# EAGLE design 2021-04-21 specMech (EAGLE 9.6.2)

## Sheet 1 of 9: Curiosity Nano
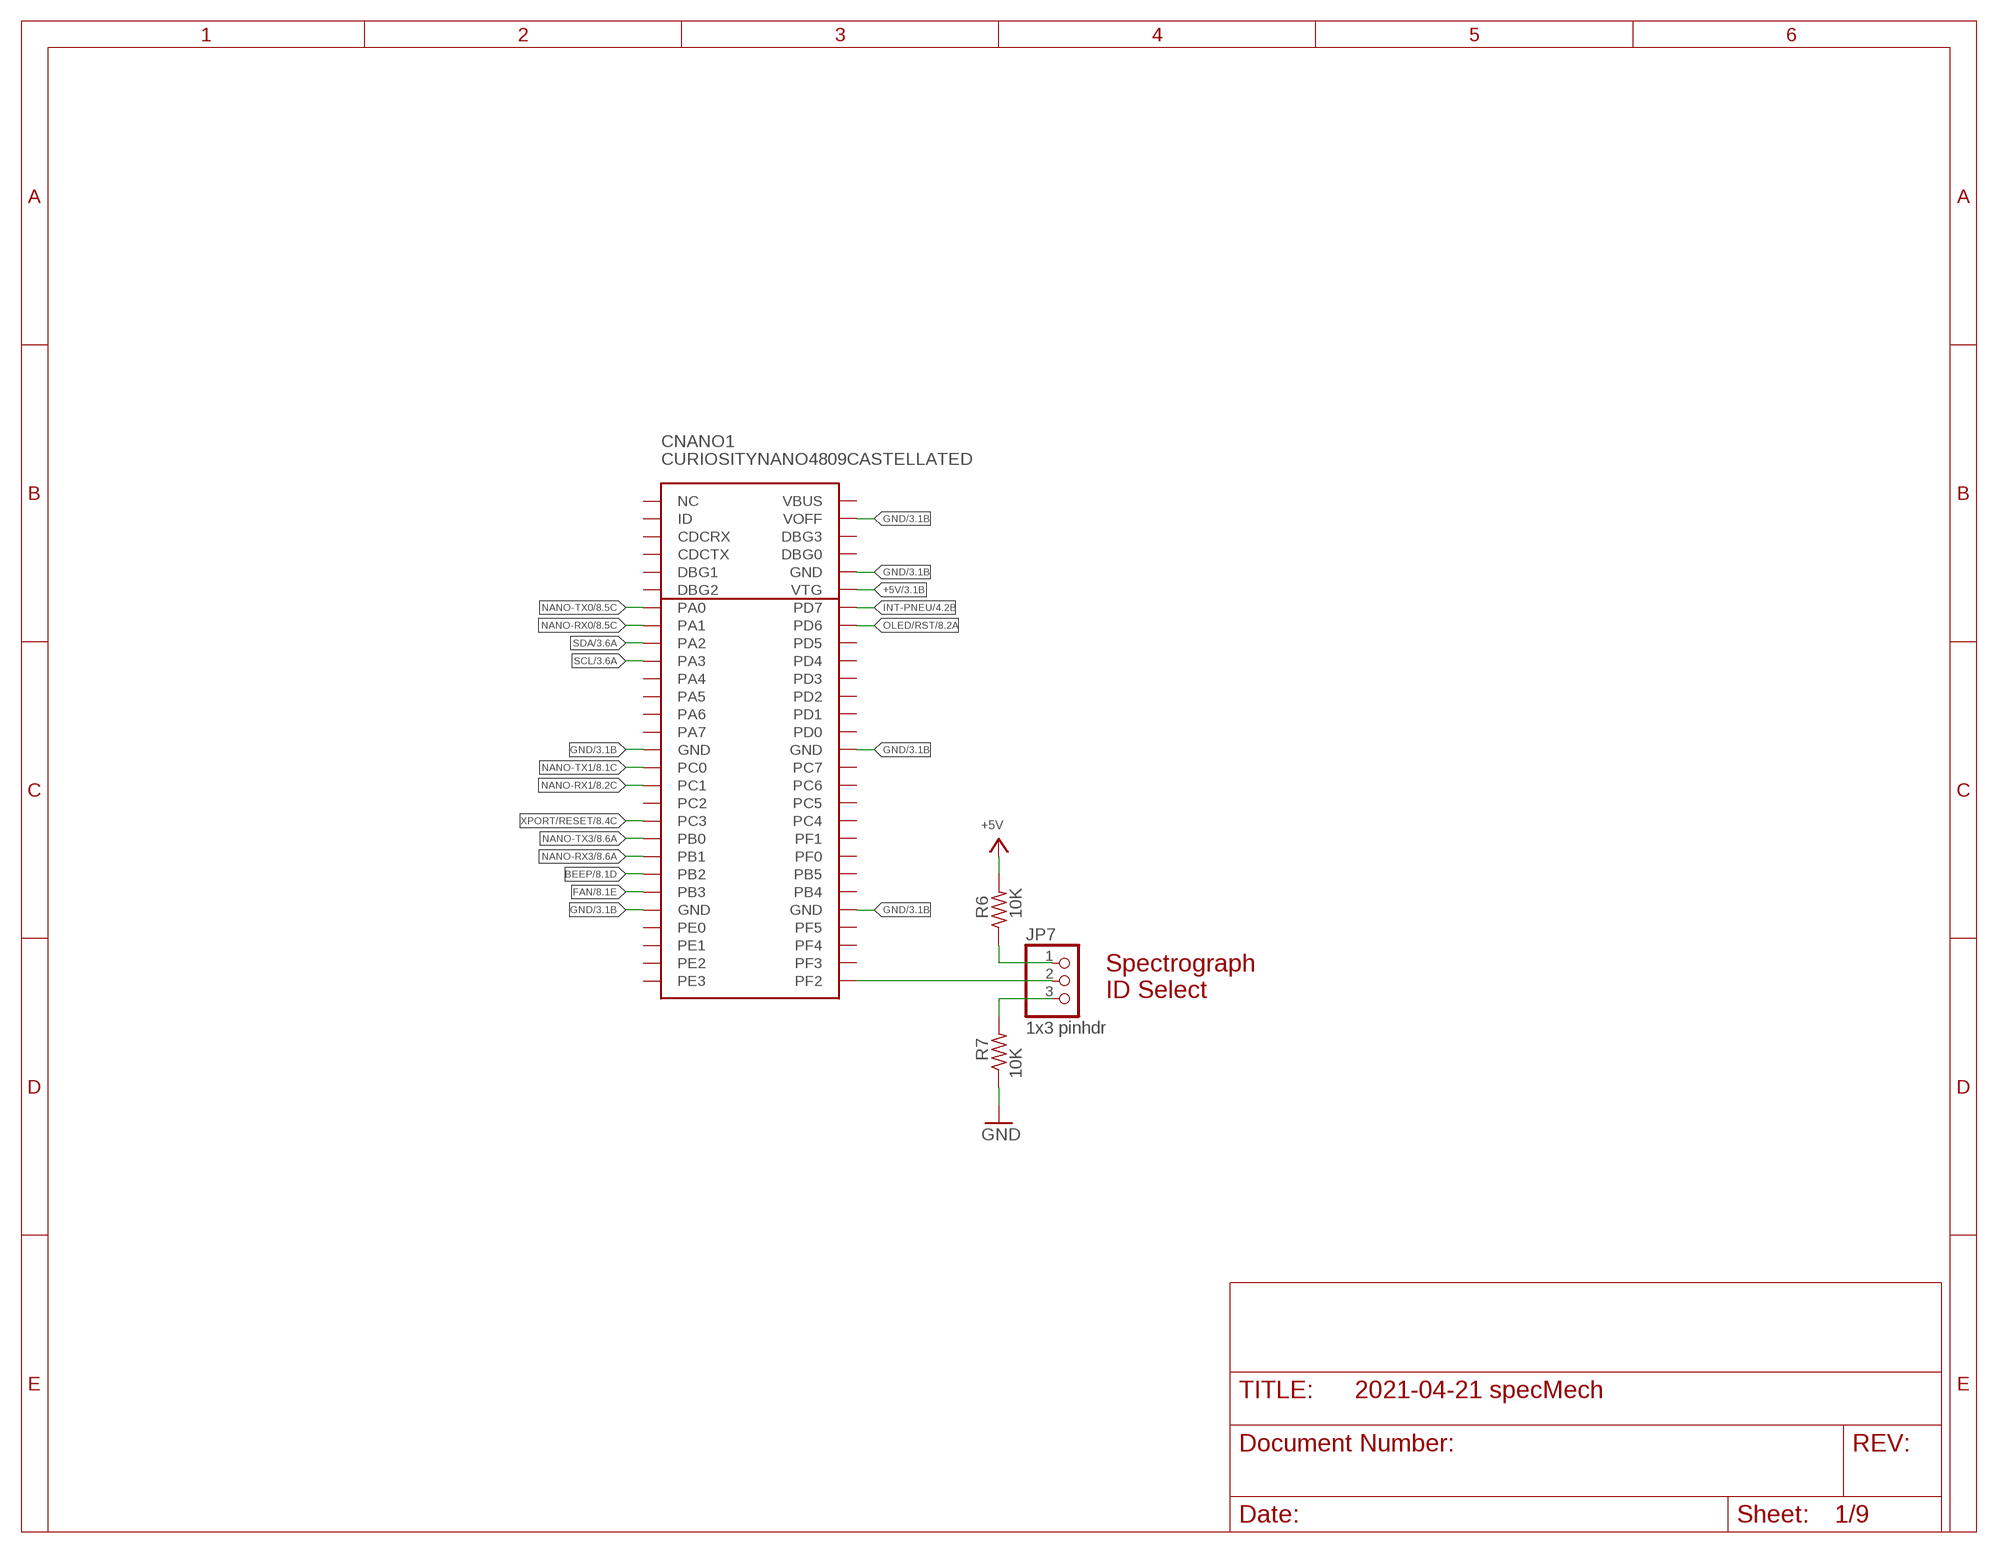
[diagram p0: schematic, sheet 1]

### Parts
CNANO1  CURIOSITYNANO4809CASTELLATED  [CURIOSITYNANO4809CASTELLATED]
JP7  1x3 pinhdr  PINHD-1X3  [1X03]
R6  10K  R-US_R0805  [R0805]
R7  10K  R-US_R0805  [R0805]

### Nets
+5V: CNANO1.VTG R6.2 ; also sheet 2,3,4,5,6,7,8,9
BEEP: CNANO1.PB2 ; also sheet 8
FAN: CNANO1.PB3 ; also sheet 8
GND: CNANO1.GND15(GND) CNANO1.GND24(GND) CNANO1.GND33(GND) CNANO1.GND42(GND) CNANO1.GND52(GND) CNANO1.VOFF R7.1 ; also sheet 2,3,4,5,6,7,8,9
INT-PNEU: CNANO1.PD7-AIN7(PD7) ; also sheet 4
N$6: CNANO1.PF2 JP7.2
N$7: JP7.3 R7.2
N$26: JP7.1 R6.1
NANO-RX0: CNANO1.PA1-RX(PA1) ; also sheet 8
NANO-RX1: CNANO1.PC1-RX(PC1) ; also sheet 8
NANO-RX3: CNANO1.PB1-RX(PB1) ; also sheet 8
NANO-TX0: CNANO1.PA0-TX(PA0) ; also sheet 8
NANO-TX1: CNANO1.PC0-TX(PC0) ; also sheet 8
NANO-TX3: CNANO1.PB0-TX(PB0) ; also sheet 8
OLED/RST: CNANO1.PD6-AIN6(PD6) ; also sheet 8
SCL: CNANO1.PA3-SCL(PA3) ; also sheet 3,4,5,6,7,8,9
SDA: CNANO1.PA2-SDA(PA2) ; also sheet 3,4,5,6,7,8,9
XPORT/RESET: CNANO1.PC3 ; also sheet 8
Unconnected: CNANO1.ID CNANO1.NC CNANO1.PA4-MOSI(PA4) CNANO1.PA5-MISO(PA5) CNANO1.PA6-SCK(PA6) CNANO1.PA7-SS(PA7) CNANO1.PB0-RX(CDCRX) CNANO1.PB1-TX(CDCTX) CNANO1.PB4 CNANO1.PB5 CNANO1.PC2 CNANO1.PC4 CNANO1.PC5 CNANO1.PC6 CNANO1.PC7 CNANO1.PD0-AIN0(PD0) CNANO1.PD1-AIN1(PD1) CNANO1.PD2-AIN2(PD2) CNANO1.PD3-AIN3(PD3) CNANO1.PD4-AIN4(PD4) CNANO1.PD5-AIN5(PD5) CNANO1.PE0 CNANO1.PE1 CNANO1.PE2 CNANO1.PE3 CNANO1.PF0-TOSC1(PF0) CNANO1.PF1-TOSC2(PF1) CNANO1.PF2-6(DBG2) CNANO1.PF3 CNANO1.PF3-5(DBG1) CNANO1.PF4 CNANO1.PF5-LED(PF5) CNANO1.PF6-SW0(DBG3) CNANO1.UPDI(DBG0) CNANO1.VBUS

### Notes on the sheet
- Spectrograph
  ID Select

## Sheet 2 of 9: +5V Power
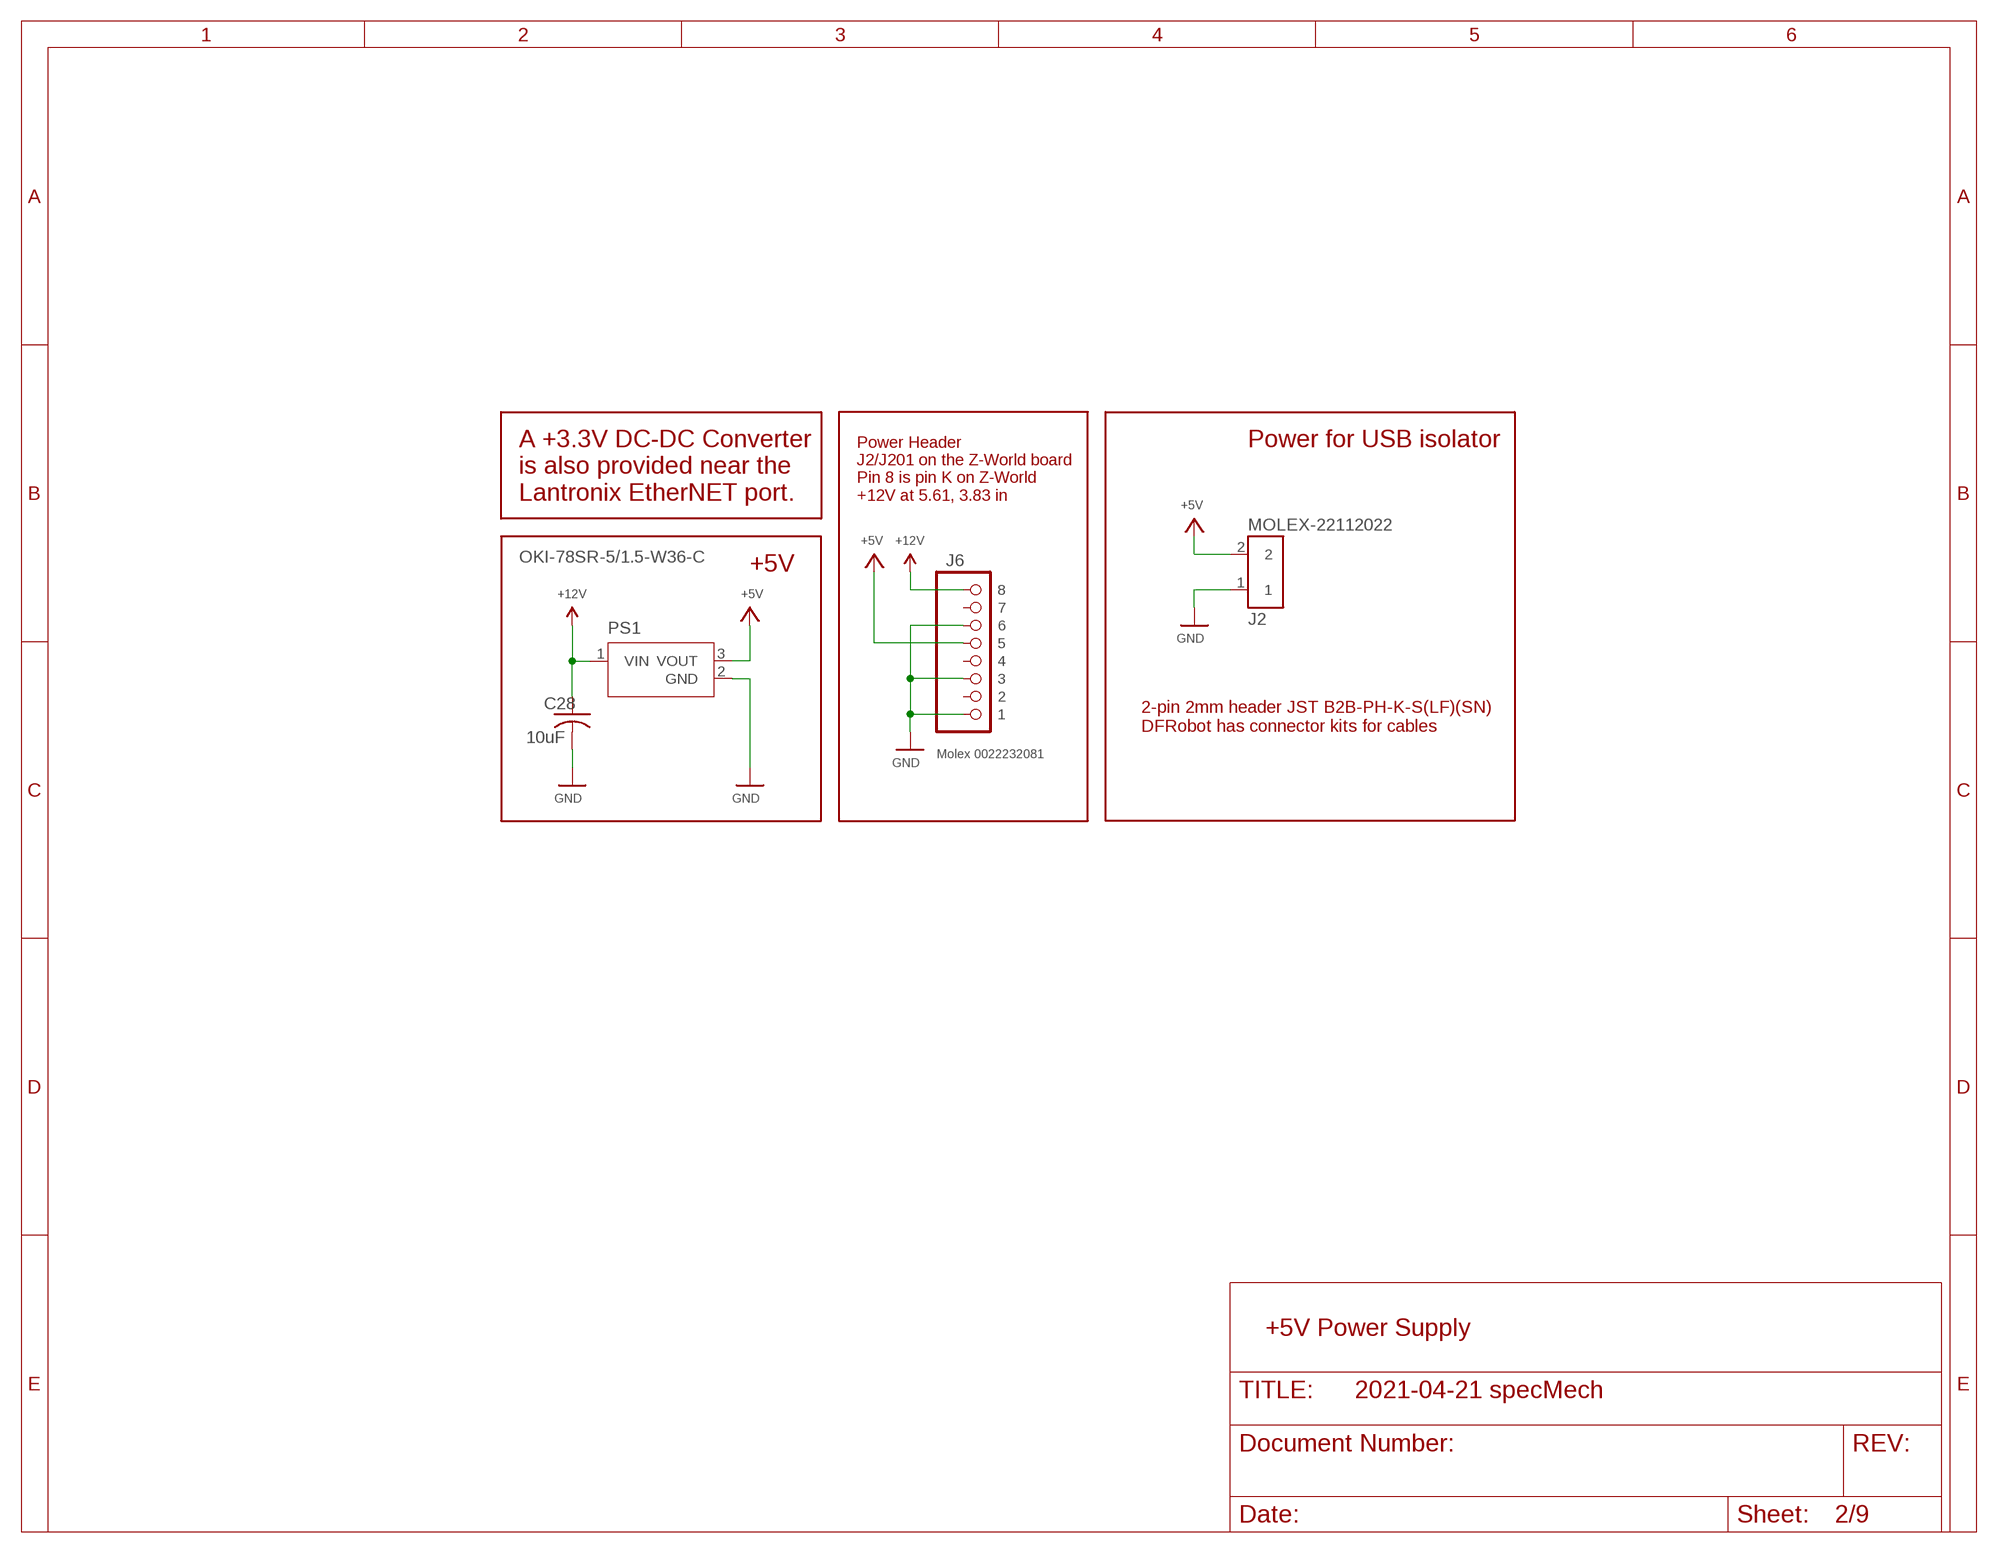
[diagram p1: schematic, sheet 2]

### Parts
C28  10uF  C-USC1210  [C1210]
J2  MOLEX-22112022  PINHD-1X2-MOLEX-22112022  [1X02-MOLEX-22112022]
J6  Molex 0022232081  PINHD-1X8-MOLEX-SHROUD  [1X08-MOLEX-SHROUD]
PS1  OKI-78SR-5/1.5-W36-C  [CONV_OKI-78SR-5/1.5-W36-C]

### Nets
+5V: J2.2 J6.P$5 PS1.3(VOUT) ; also sheet 1,3,4,5,6,7,8,9
+12V: C28.1 J6.P$8 PS1.1(VIN) ; also sheet 5,8,9
GND: C28.2 J2.1 J6.P$1 J6.P$3 J6.P$6 PS1.2(GND) ; also sheet 1,3,4,5,6,7,8,9
Unconnected: J6.P$2 J6.P$4 J6.P$7

### Notes on the sheet
- Power for USB isolator
- A +3.3V DC-DC Converter
  is also provided near the
  Lantronix EtherNET port.
- Power Header
  J2/J201 on the Z-World board
  Pin 8 is pin K on Z-World
  +12V at 5.61, 3.83 in
- +5V
- 2-pin 2mm header JST B2B-PH-K-S(LF)(SN)
  DFRobot has connector kits for cables
- +5V Power Supply

## Sheet 3 of 9: Miscellaneous peripherals
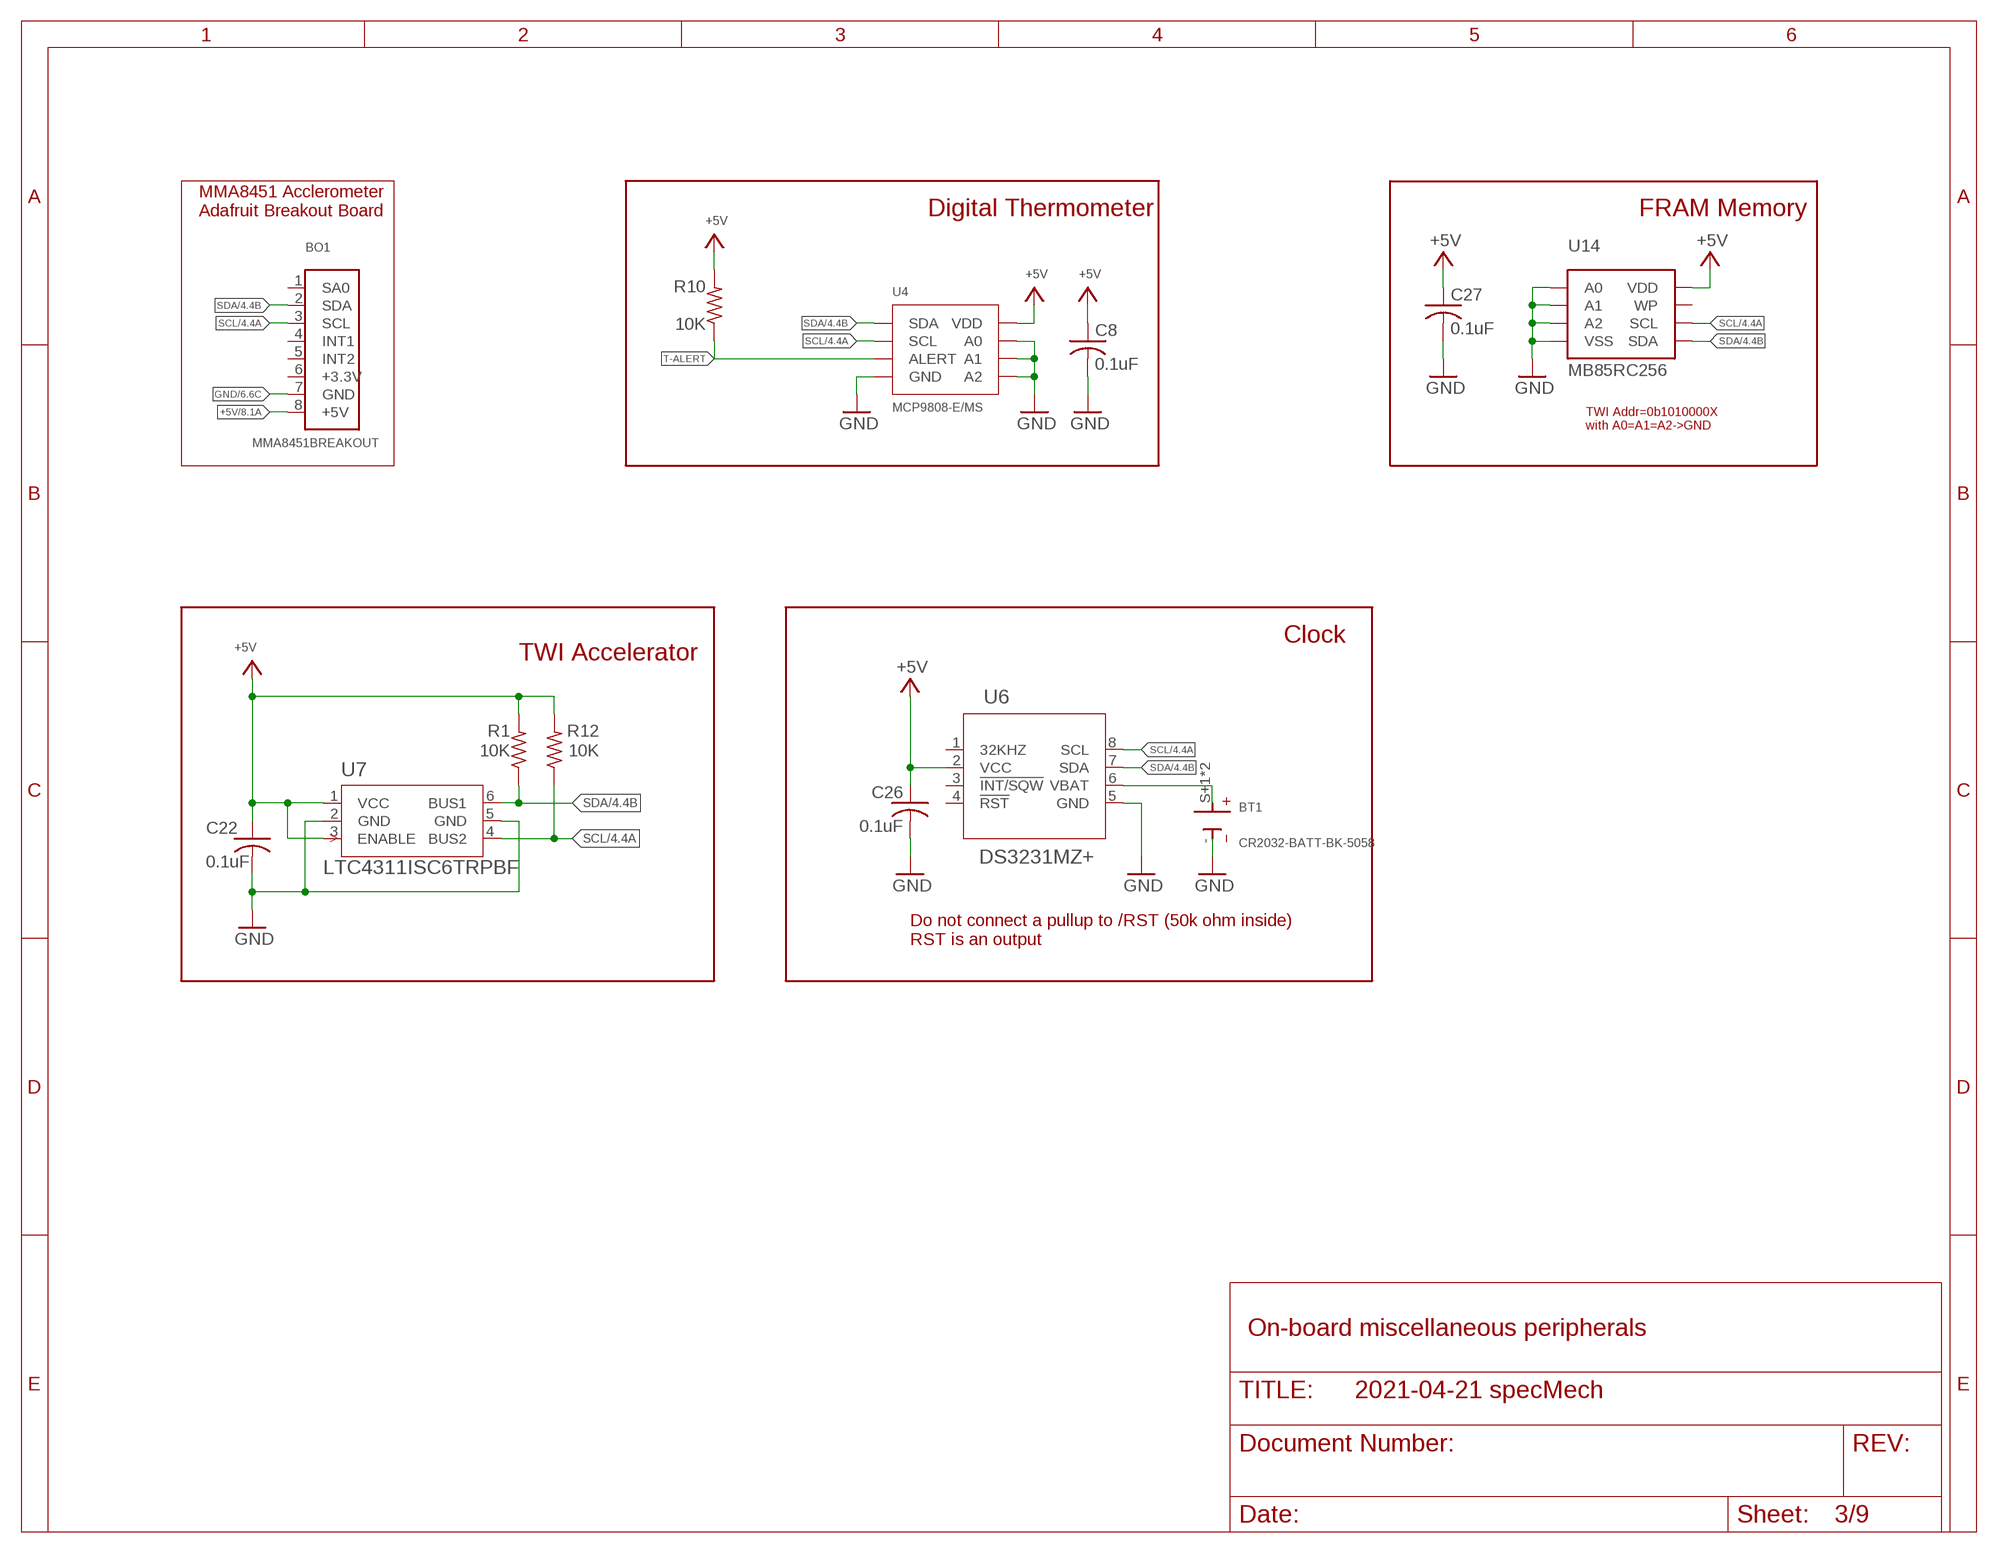
[diagram p2: schematic, sheet 3]

### Parts
BO1  MMA8451BREAKOUT  [1X08]
BT1  CR2032-BATT-BK-5058  [BAT_BK-5058]
C8  0.1uF  C-USC0805  [C0805]
C22  0.1uF  C-USC0805  [C0805]
C26  0.1uF  C-USC0805  [C0805]
C27  0.1uF  C-USC0805  [C0805]
R1  10K  R-US_R0805  [R0805]
R10  10K  R-US_R0805  [R0805]
R12  10K  R-US_R0805  [R0805]
U4  MCP9808-E/MS  [MSOP8_MC_MCH]
U6  DS3231MZ+  [21-0041B_8]
U7  LTC4311ISC6TRPBF  [SOT-6_SC_LIT]
U14  MB85RC256  MB85RC512FPT-FP-DUALWIDTH  [SOIC127P797X210-8N]

### Nets
+5V: BO1.8(+5V) C8.1 C22.1 C26.1 C27.1 R1.2 R10.2 R12.2 U4.8(VDD) U6.2(VCC) U7.1(VCC) U7.3(ENABLE) U14.8(VDD) ; also sheet 1,2,4,5,6,7,8,9
GND: BO1.7(GND) BT1.- C8.2 C22.2 C26.2 C27.2 U4.4(GND) U4.5(A2) U4.6(A1) U4.7(A0) U6.5(GND) U7.2(GND) U7.5(GND) U14.1(A0) U14.2(A1) U14.3(A2) U14.4(VSS) ; also sheet 1,2,4,5,6,7,8,9
SCL: BO1.3(SCL) R12.1 U4.2(SCL) U6.8(SCL) U7.4(BUS2) U14.6(SCL) ; also sheet 1,4,5,6,7,8,9
SDA: BO1.2(SDA) R1.1 U4.1(SDA) U6.7(SDA) U7.6(BUS1) U14.5(SDA) ; also sheet 1,4,5,6,7,8,9
T-ALERT: R10.1 U4.3(ALERT)
VBAT: BT1.S+1(+) BT1.S+2(+) U6.6(VBAT)
Unconnected: BO1.1(SA0) BO1.4(INT1) BO1.5(INT2) BO1.6(+3.3V) U6.1(32KHZ) U6.3(!INT/SQW) U6.4(!RST) U14.7(WP)

### Notes on the sheet
- MMA8451 Acclerometer
  Adafruit Breakout Board
- Digital Thermometer | FRAM Memory
- TWI Addr=0b1010000X
  with A0=A1=A2->GND
- Clock
- TWI Accelerator
- Do not connect a pullup to /RST (50k ohm inside)
  RST is an output
- On-board miscellaneous peripherals

## Sheet 4 of 9: Digital Input Port Expander
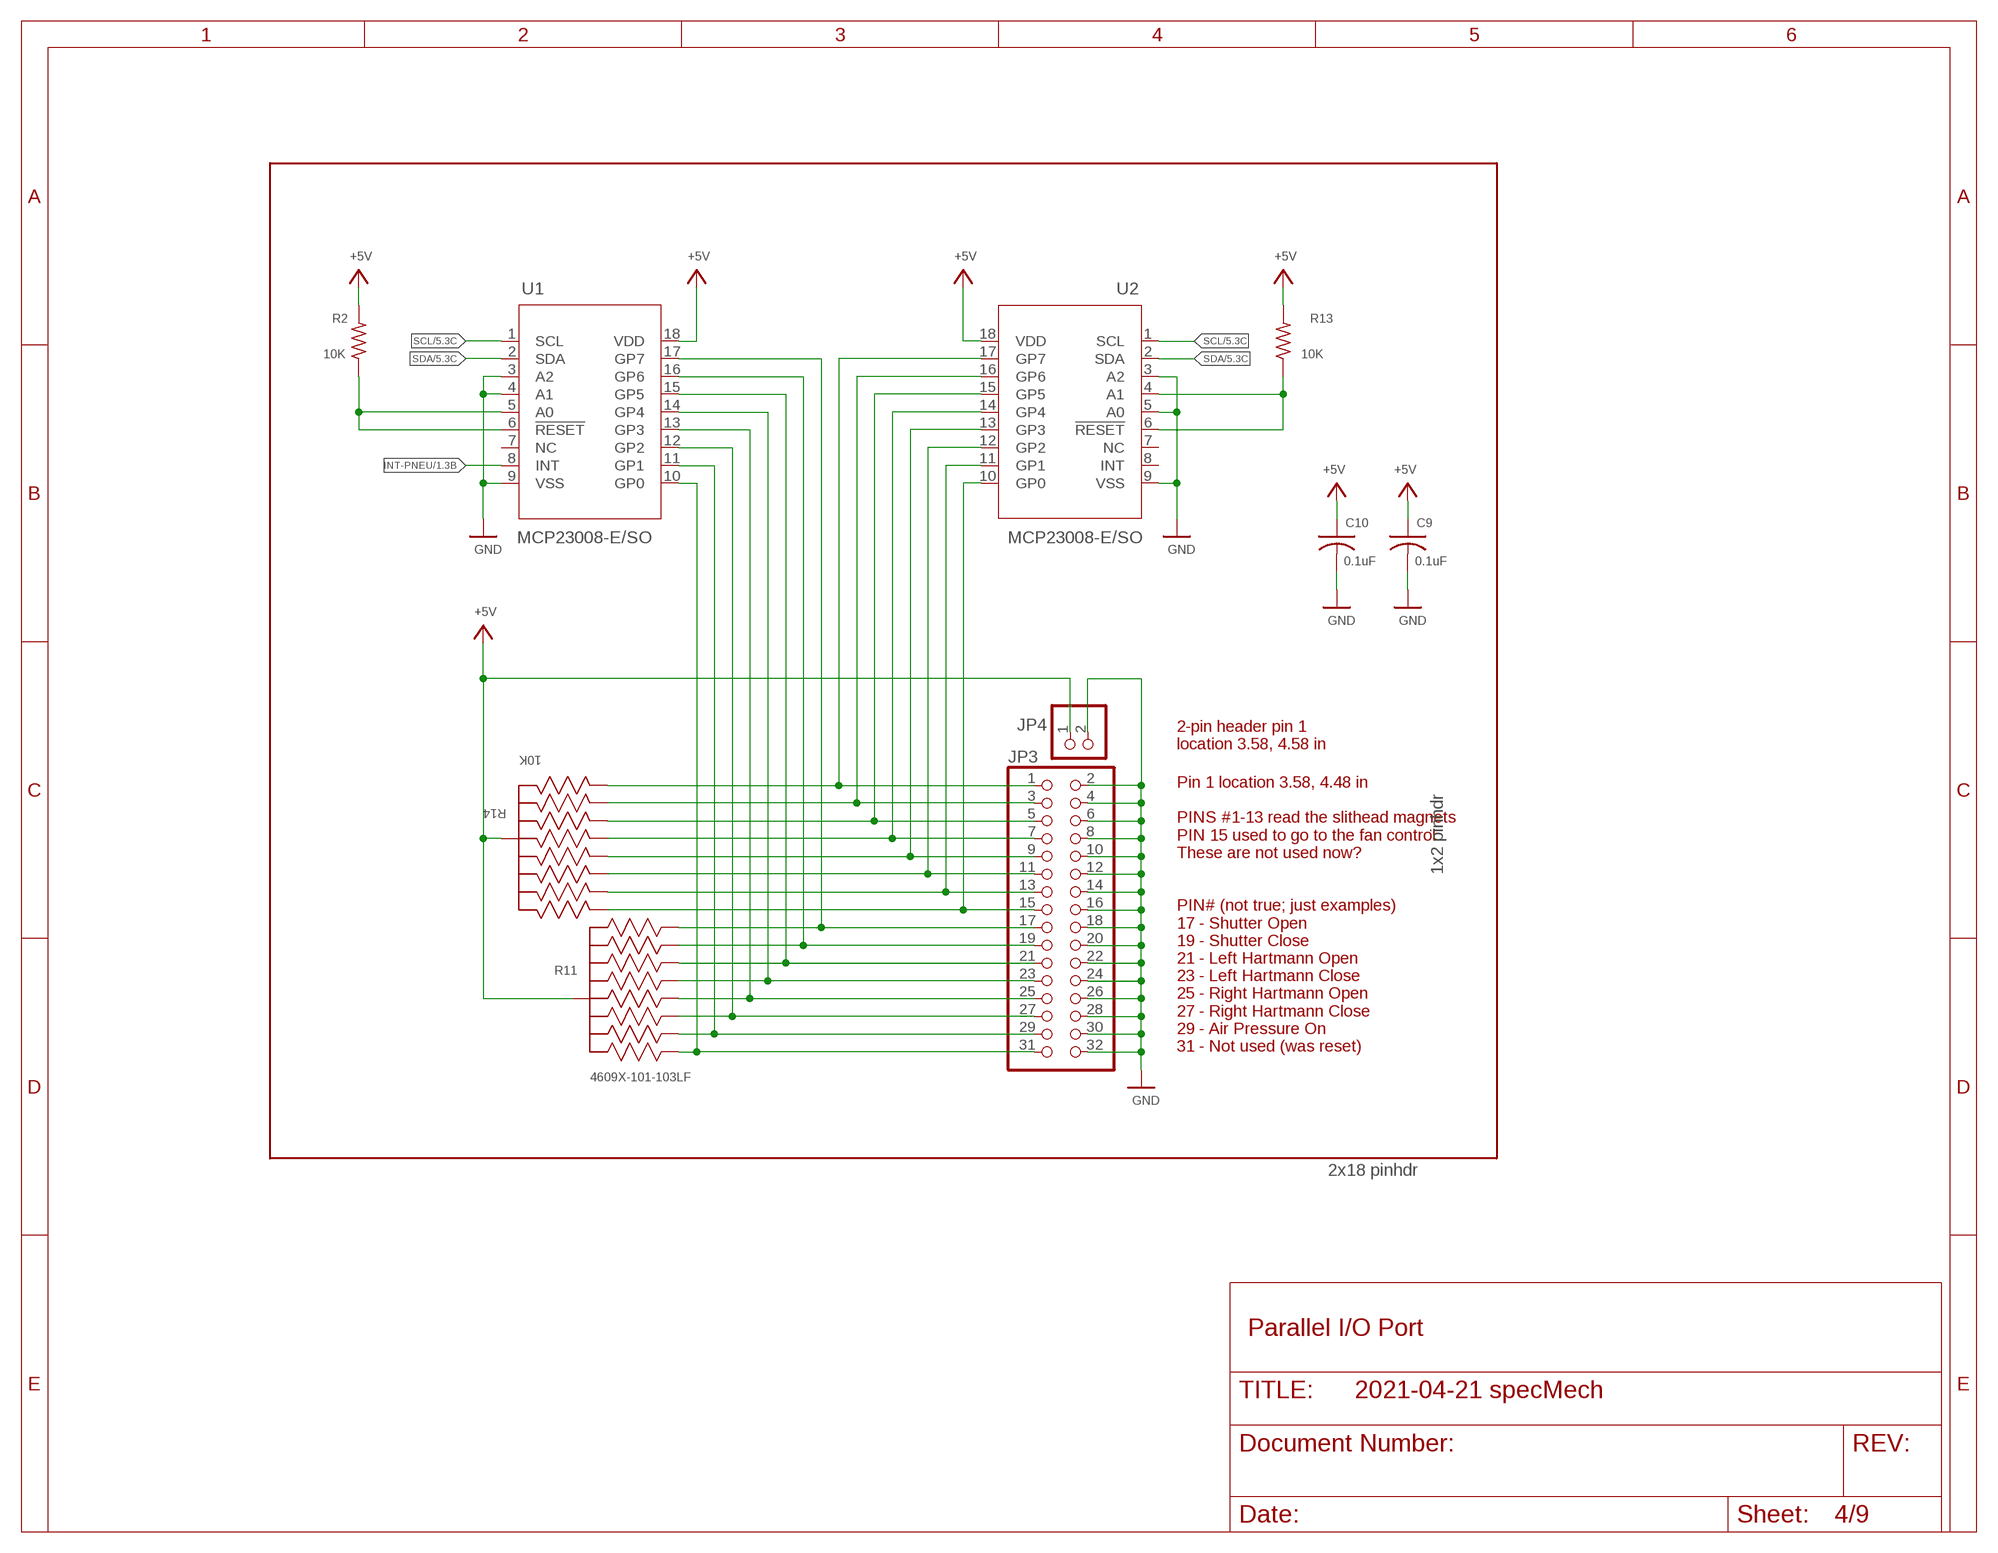
[diagram p3: schematic, sheet 4]

### Parts
C9  0.1uF  C-USC0805  [C0805]
C10  0.1uF  C-USC0805  [C0805]
JP3  2x18 pinhdr  PINHD-2X16  [2X16]
JP4  1x2 pinhdr  PINHD-1X2  [1X02]
R2  10K  R-US_R0805  [R0805]
R11  4609X-101-103LF  [BO_4609X]
R13  10K  R-US_R0805  [R0805]
R14  10K  4609X-101-103LF  [BO_4609X]
U1  MCP23008-E/SO  [SOIC18-W_MC]
U2  MCP23008-E/SO  [SOIC18-W_MC]

### Nets
+5V: C9.1 C10.1 JP4.1 R2.2 R11.1 R13.2 R14.1 U1.18(VDD) U2.18(VDD) ; also sheet 1,2,3,5,6,7,8,9
GND: C9.2 C10.2 JP3.2 JP3.4 JP3.6 JP3.8 JP3.10 JP3.12 JP3.14 JP3.16 JP3.18 JP3.20 JP3.22 JP3.24 JP3.26 JP3.28 JP3.30 JP3.32 JP4.2 U1.3(A2) U1.4(A1) U1.9(VSS) U2.3(A2) U2.5(A0) U2.9(VSS) ; also sheet 1,2,3,5,6,7,8,9
INT-PNEU: U1.8(INT) ; also sheet 1
N$1: JP3.1 R14.2 U2.17(GP7)
N$2: JP3.3 R14.3 U2.16(GP6)
N$3: JP3.5 R14.4 U2.15(GP5)
N$4: JP3.7 R14.5 U2.14(GP4)
N$9: JP3.17 R11.9 U1.17(GP7)
N$10: JP3.19 R11.8 U1.16(GP6)
N$11: JP3.21 R11.7 U1.15(GP5)
N$12: JP3.23 R11.6 U1.14(GP4)
N$13: JP3.25 R11.5 U1.13(GP3)
N$14: R2.1 U1.5(A0) U1.6(!RESET)
N$15: JP3.29 R11.3 U1.11(GP1)
N$16: JP3.31 R11.2 U1.10(GP0)
N$17: JP3.11 R14.7 U2.12(GP2)
N$20: JP3.27 R11.4 U1.12(GP2)
N$21: JP3.13 R14.8 U2.11(GP1)
N$22: JP3.15 R14.9 U2.10(GP0)
N$24: R13.1 U2.4(A1) U2.6(!RESET)
N$36: JP3.9 R14.6 U2.13(GP3)
SCL: U1.1(SCL) U2.1(SCL) ; also sheet 1,3,5,6,7,8,9
SDA: U1.2(SDA) U2.2(SDA) ; also sheet 1,3,5,6,7,8,9
Unconnected: U1.7(NC) U2.7(NC) U2.8(INT)

### Notes on the sheet
- 2-pin header pin 1
  location 3.58, 4.58 in
- Pin 1 location 3.58, 4.48 in
  
  PINS #1-13 read the slithead magnets
  PIN 15 used to go to the fan control
  These are not used now?
  
  
  PIN# (not true; just examples)
  17 - Shutter Open
  19 - Shutter Close
  21 - Left Hartmann Open
  23 - Left Hartmann Close
  25 - Right Hartmann Open
  27 - Right Hartmann Close
  29 - Air Pressure On
  31 - Not used (was reset)
- Parallel I/O Port

## Sheet 5 of 9: High Current Output
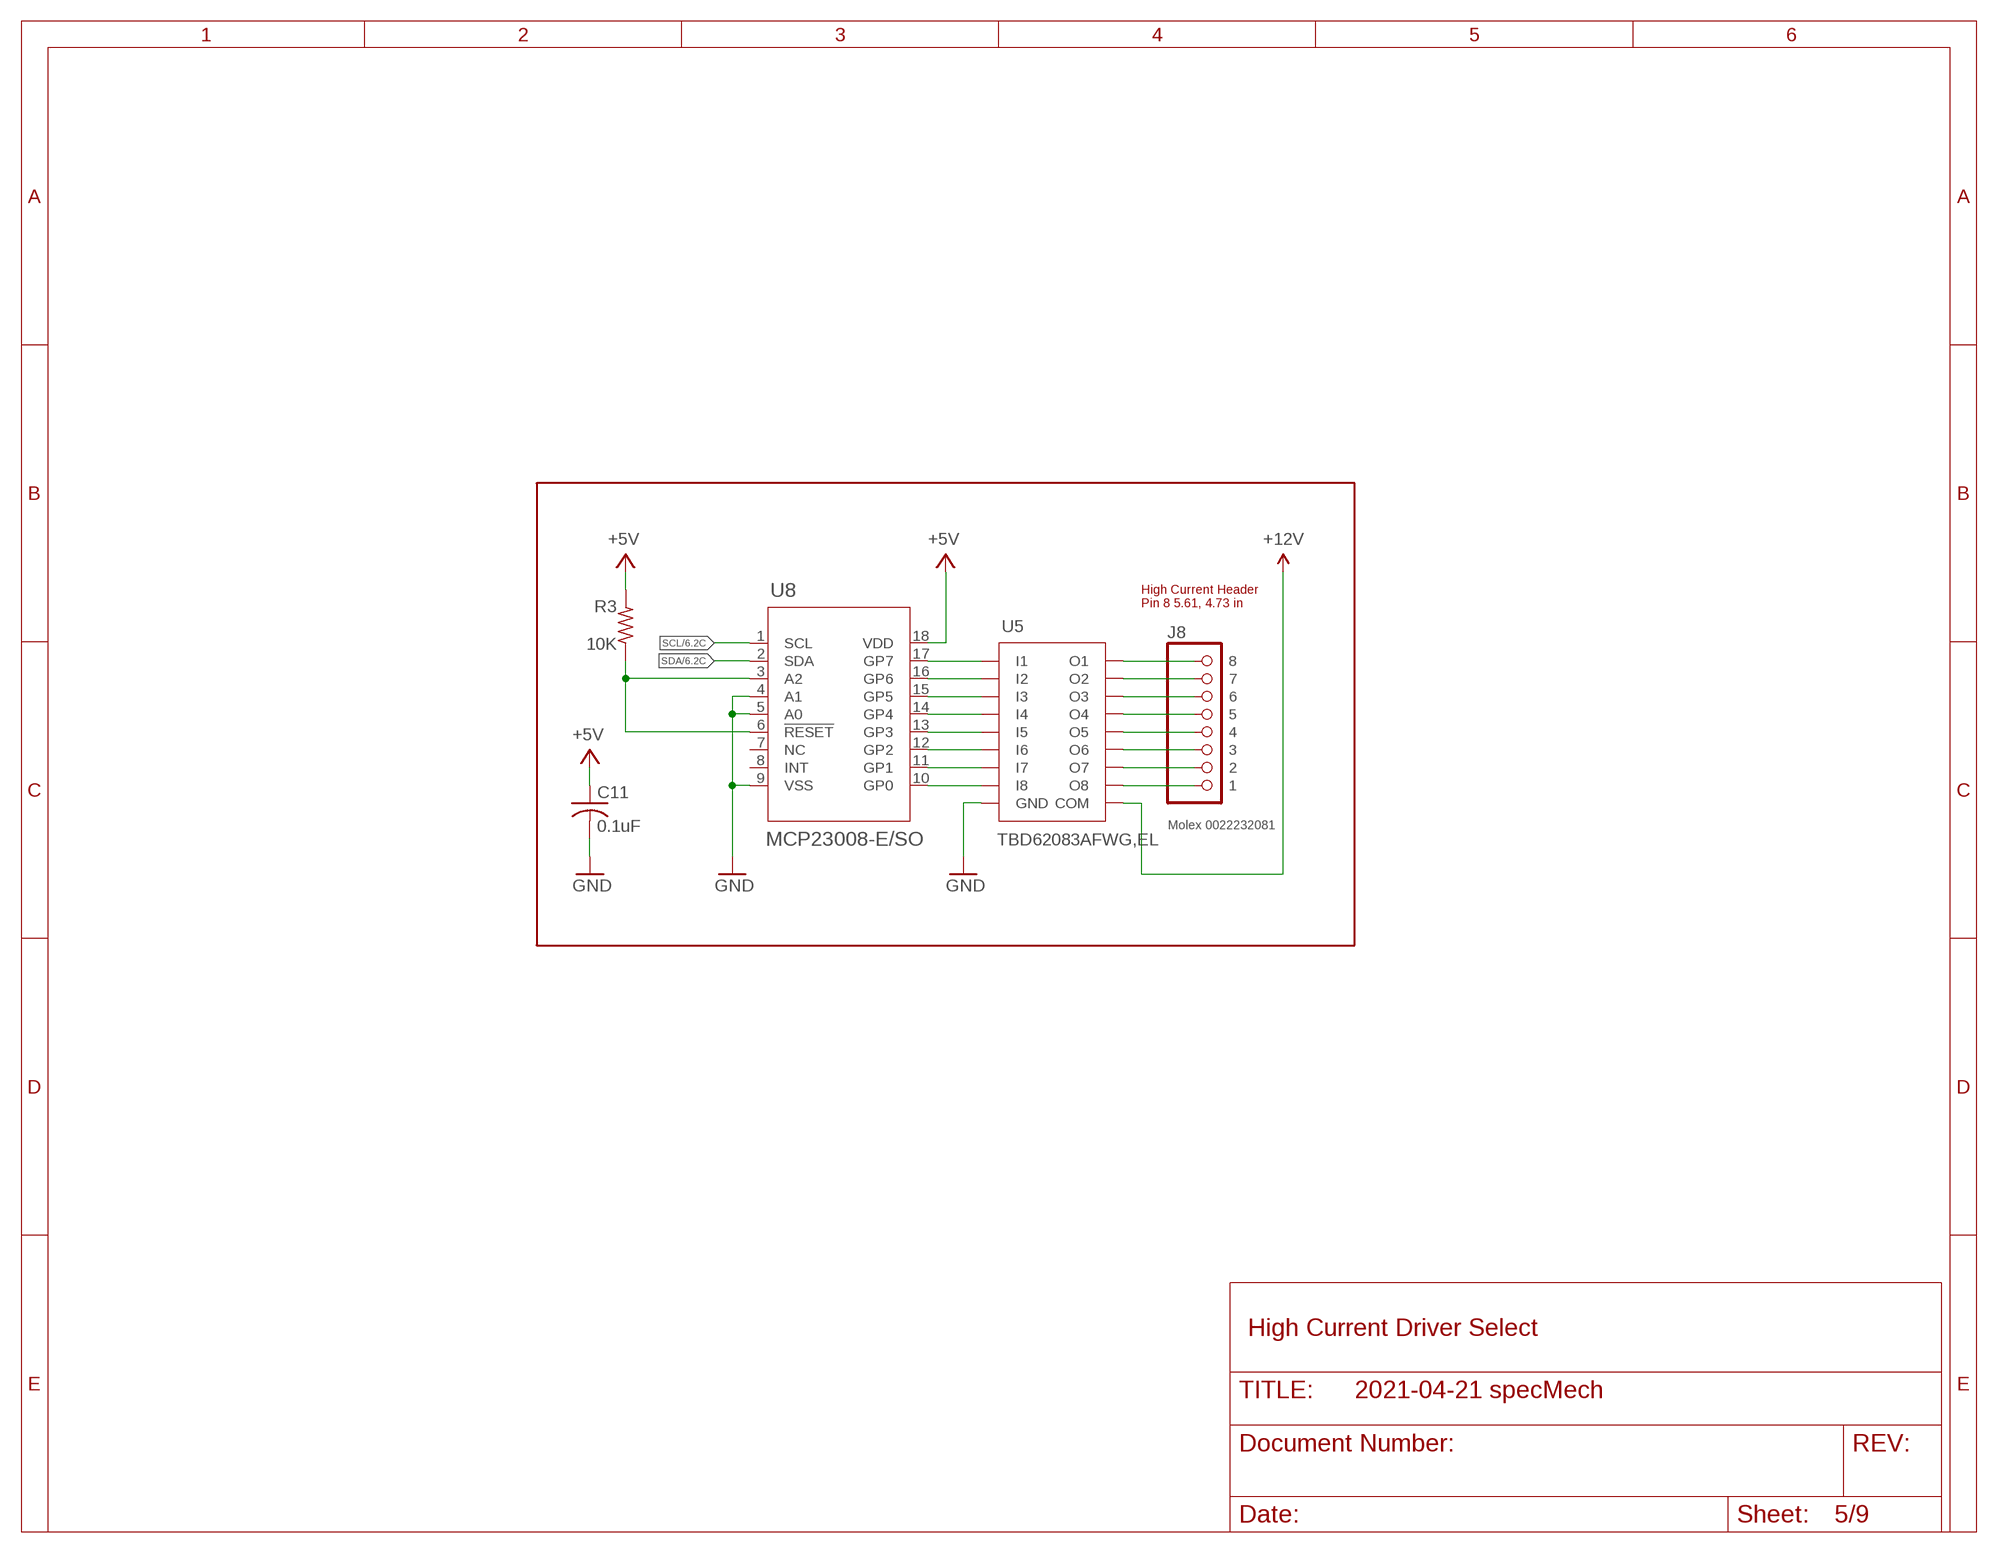
[diagram p4: schematic, sheet 5]

### Parts
C11  0.1uF  C-USC0805  [C0805]
J8  Molex 0022232081  PINHD-1X8-MOLEX-SHROUD  [1X08-MOLEX-SHROUD]
R3  10K  R-US_R0805  [R0805]
U5  TBD62083AFWG,EL  TBD62083SOP18-P-375-1.27  [SOIC127P1030X245-18]
U8  MCP23008-E/SO  [SOIC18-W_MC]

### Nets
+5V: C11.1 R3.2 U8.18(VDD) ; also sheet 1,2,3,4,6,7,8,9
+12V: U5.10(COM) ; also sheet 2,8,9
GND: C11.2 U5.9(GND) U8.4(A1) U8.5(A0) U8.9(VSS) ; also sheet 1,2,3,4,6,7,8,9
N$37: U5.1(I1) U8.17(GP7)
N$38: U5.2(I2) U8.16(GP6)
N$39: U5.3(I3) U8.15(GP5)
N$44: U5.4(I4) U8.14(GP4)
N$45: U5.5(I5) U8.13(GP3)
N$46: U5.6(I6) U8.12(GP2)
N$47: U5.7(I7) U8.11(GP1)
N$48: U5.8(I8) U8.10(GP0)
N$49: R3.1 U8.3(A2) U8.6(!RESET)
N$50: J8.P$8 U5.18(O1)
N$51: J8.P$1 U5.11(O8)
N$52: J8.P$2 U5.12(O7)
N$53: J8.P$3 U5.13(O6)
N$54: J8.P$4 U5.14(O5)
N$55: J8.P$5 U5.15(O4)
N$56: J8.P$6 U5.16(O3)
N$57: J8.P$7 U5.17(O2)
SCL: U8.1(SCL) ; also sheet 1,3,4,6,7,8,9
SDA: U8.2(SDA) ; also sheet 1,3,4,6,7,8,9
Unconnected: U8.7(NC) U8.8(INT)

### Notes on the sheet
- High Current Header
  Pin 8 5.61, 4.73 in
- High Current Driver Select

## Sheet 6 of 9: Analog Inputs
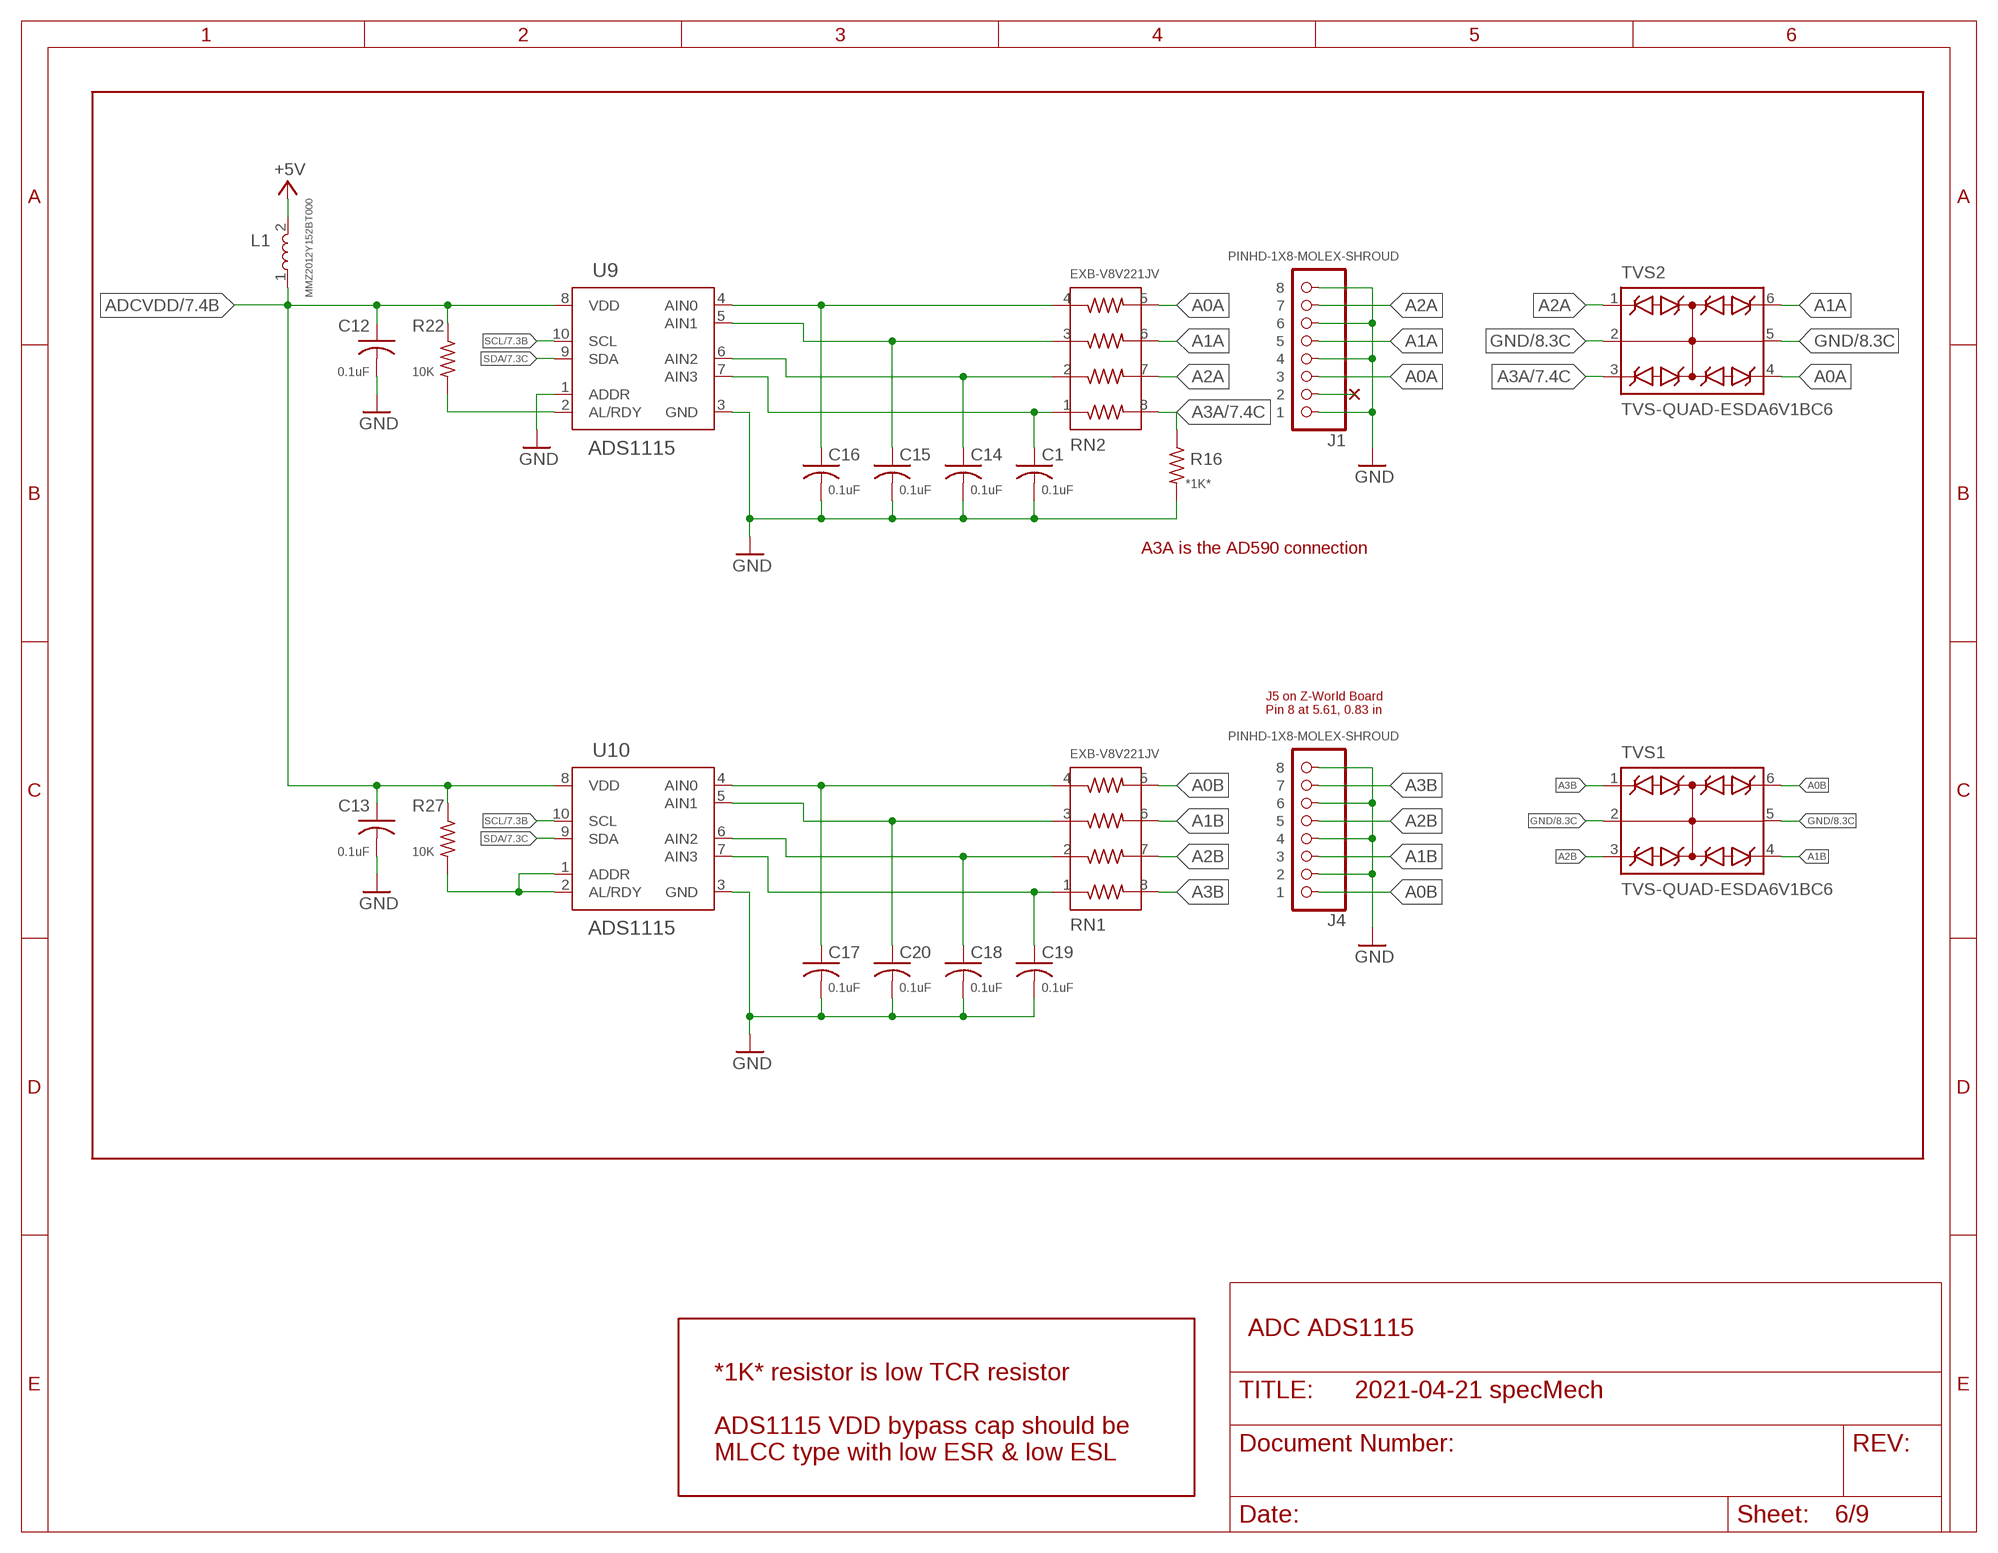
[diagram p5: schematic, sheet 6]

### Parts
C1  0.1uF  C-USC0805  [C0805]
C12  0.1uF  C-USC0805  [C0805]
C13  0.1uF  C-USC0805  [C0805]
C14  0.1uF  C-USC0805  [C0805]
C15  0.1uF  C-USC0805  [C0805]
C16  0.1uF  C-USC0805  [C0805]
C17  0.1uF  C-USC0805  [C0805]
C18  0.1uF  C-USC0805  [C0805]
C19  0.1uF  C-USC0805  [C0805]
C20  0.1uF  C-USC0805  [C0805]
J1  PINHD-1X8-MOLEX-SHROUD  [1X08-MOLEX-SHROUD]
J4  PINHD-1X8-MOLEX-SHROUD  [1X08-MOLEX-SHROUD]
L1  MMZ2012Y152BT000  [INDC2012X87N]
R16  *1K*  R-US_R0805  [R0805]
R22  10K  R-US_R0805  [R0805]
R27  10K  R-US_R0805  [R0805]
RN1  EXB-V8V221JV  EXB-38V103JV  [EXB38V_PAN]
RN2  EXB-V8V221JV  EXB-38V103JV  [EXB38V_PAN]
TVS1  TVS-QUAD-ESDA6V1BC6  [SOT95P280X145-6N]
TVS2  TVS-QUAD-ESDA6V1BC6  [SOT95P280X145-6N]
U9  ADS1115  ADS1115IDGSRVSSOP-10  [SOP50P490X110-10N]
U10  ADS1115  ADS1115IDGSRVSSOP-10  [SOP50P490X110-10N]

### Nets
+5V: L1.2 ; also sheet 1,2,3,4,5,7,8,9
A0A: J1.P$3 RN2.5 TVS2.4(C3)
A0B: J4.P$1 RN1.5 TVS1.6(C4)
A1A: J1.P$5 RN2.6 TVS2.6(C4)
A1B: J4.P$3 RN1.6 TVS1.4(C3)
A2A: J1.P$7 RN2.7 TVS2.1(C1)
A2B: J4.P$5 RN1.7 TVS1.3(C2)
A3A: R16.1 RN2.8 TVS2.3(C2) ; also sheet 7
A3B: J4.P$7 RN1.8 TVS1.1(C1)
ADCVDD: C12.1 C13.1 L1.1 R22.1 R27.1 U9.8(VDD) U10.8(VDD) ; also sheet 7
GND: C1.2 C12.2 C13.2 C14.2 C15.2 C16.2 C17.2 C18.2 C19.2 C20.2 J1.P$1 J1.P$4 J1.P$6 J1.P$8 J4.P$2 J4.P$4 J4.P$6 J4.P$8 R16.2 TVS1.2(CC1) TVS1.5(CC2) TVS2.2(CC1) TVS2.5(CC2) U9.1(ADDR) U9.3(GND) U10.3(GND) ; also sheet 1,2,3,4,5,7,8,9
N$27: J1.P$2
N$28: C1.1 RN2.1 U9.7(AIN3)
N$62: C16.1 RN2.4 U9.4(AIN0)
N$63: C15.1 RN2.3 U9.5(AIN1)
N$64: R22.2 U9.2(AL/RDY)
N$65: C19.1 RN1.1 U10.7(AIN3)
N$66: C14.1 RN2.2 U9.6(AIN2)
N$67: C18.1 RN1.2 U10.6(AIN2)
N$68: C20.1 RN1.3 U10.5(AIN1)
N$69: C17.1 RN1.4 U10.4(AIN0)
N$70: R27.2 U10.1(ADDR) U10.2(AL/RDY)
SCL: U9.10(SCL) U10.10(SCL) ; also sheet 1,3,4,5,7,8,9
SDA: U9.9(SDA) U10.9(SDA) ; also sheet 1,3,4,5,7,8,9

### Notes on the sheet
- A3A is the AD590 connection
- J5 on Z-World Board
  Pin 8 at 5.61, 0.83 in
- ADC ADS1115
- *1K* resistor is low TCR resistor
  
  ADS1115 VDD bypass cap should be
  MLCC type with low ESR & low ESL

## Sheet 7 of 9: AD590 Temp Sensor Selector
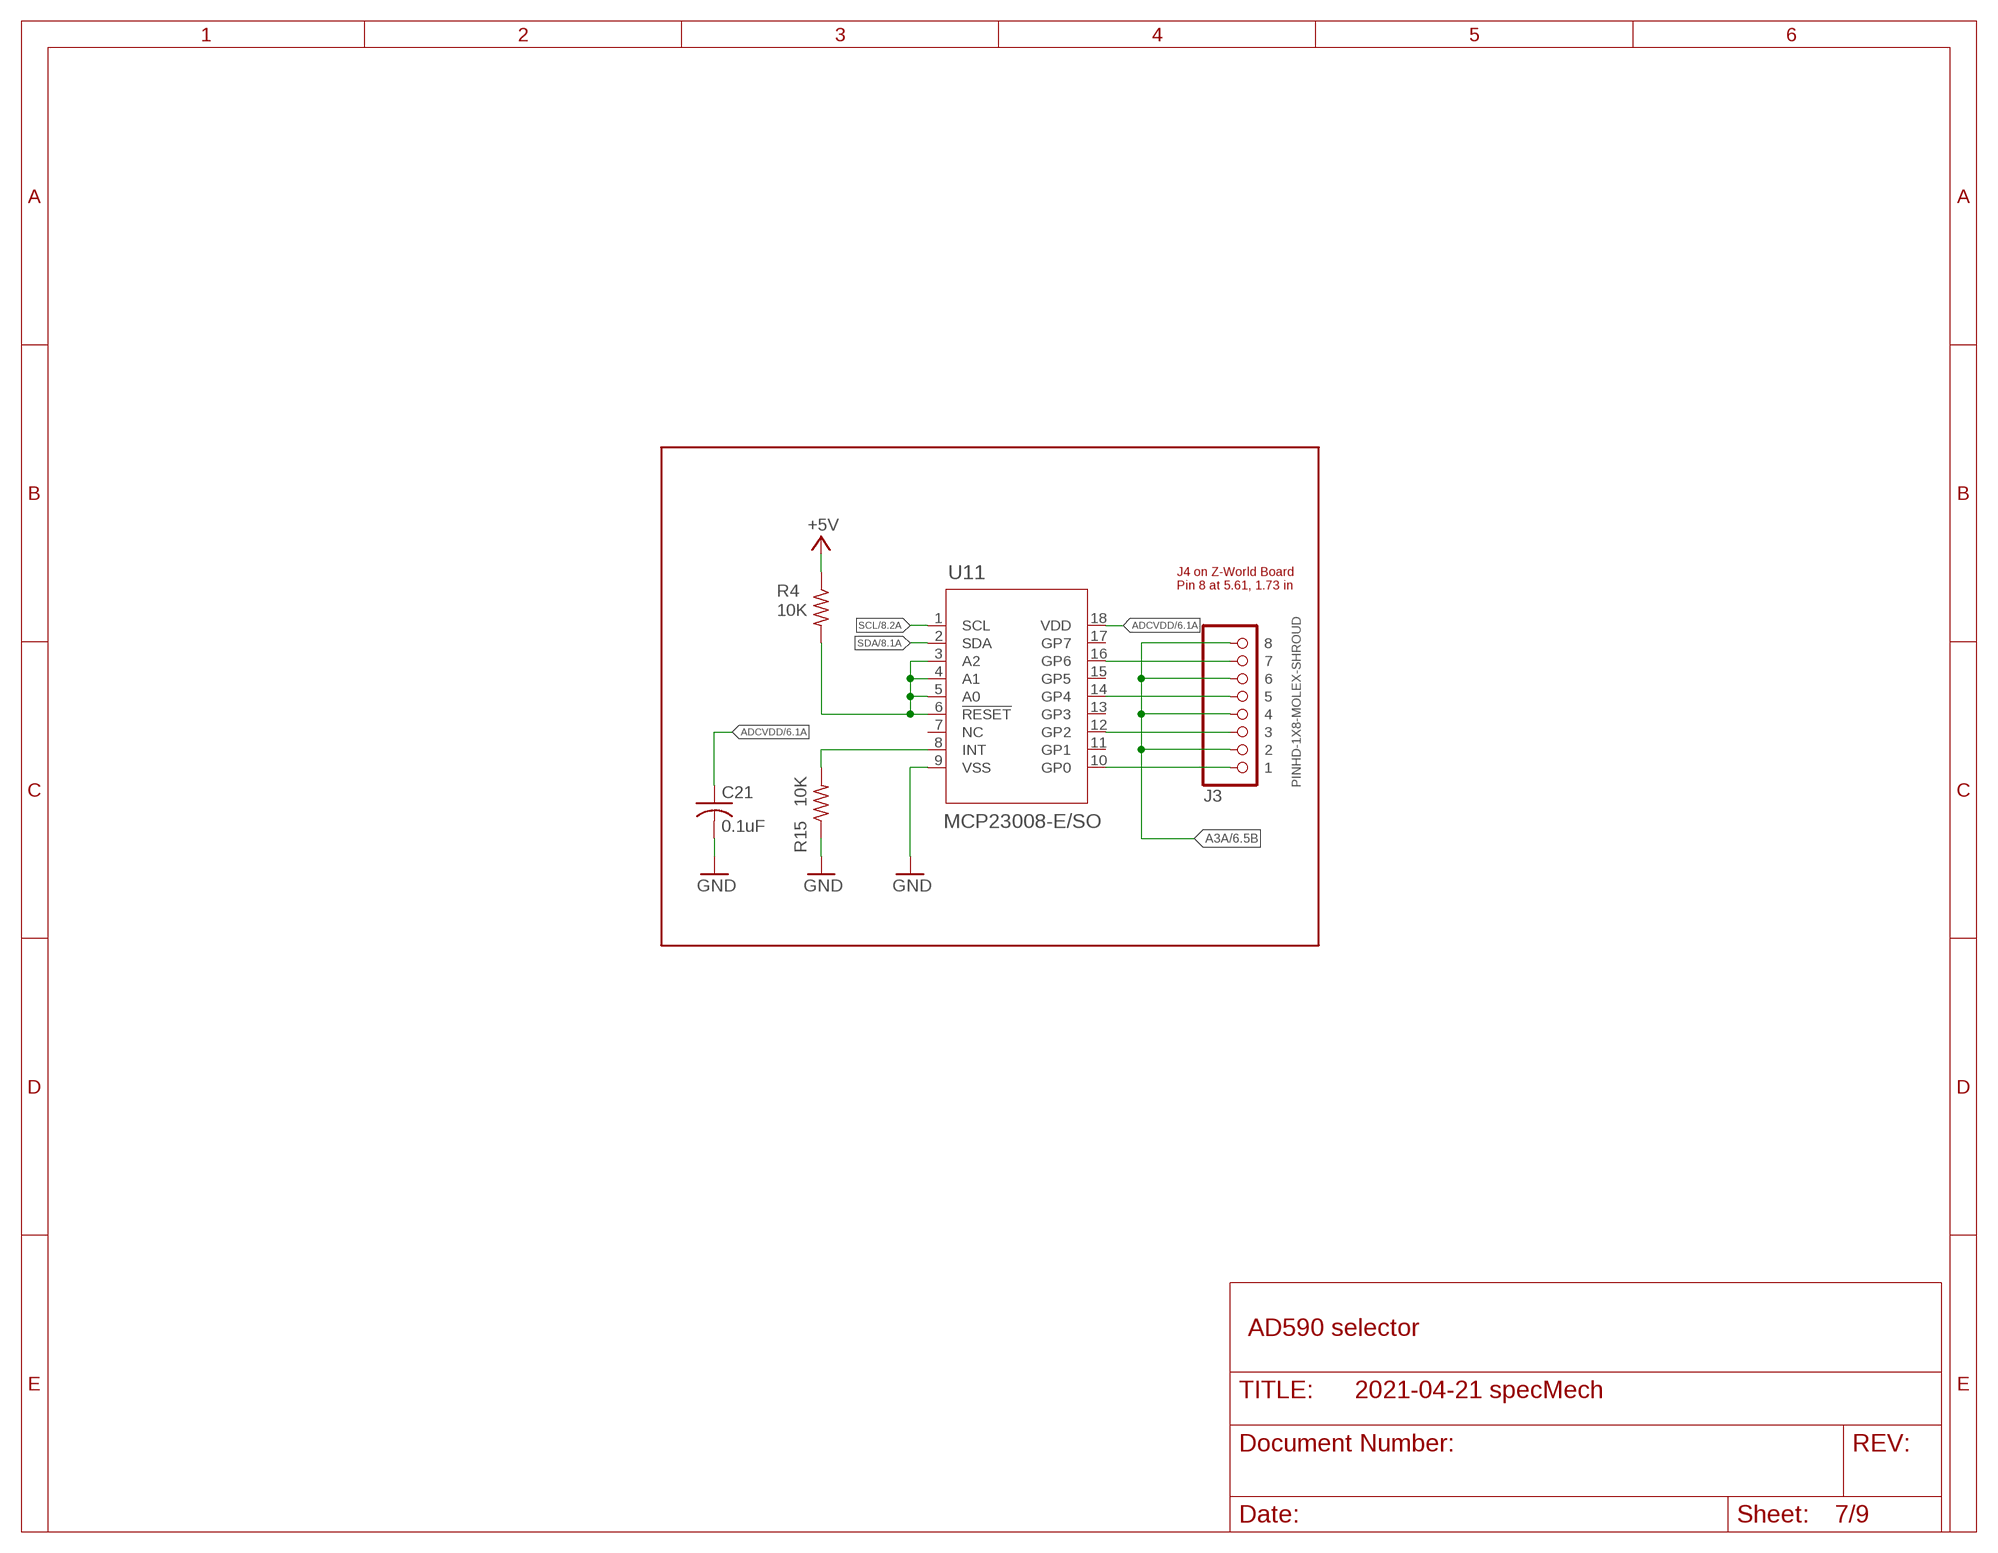
[diagram p6: schematic, sheet 7]

### Parts
C21  0.1uF  C-USC0805  [C0805]
J3  PINHD-1X8-MOLEX-SHROUD  [1X08-MOLEX-SHROUD]
R4  10K  R-US_R0805  [R0805]
R15  10K  R-US_R0805  [R0805]
U11  MCP23008-E/SO  [SOIC18-W_MC]

### Nets
+5V: R4.1 ; also sheet 1,2,3,4,5,6,8,9
A3A: J3.P$2 J3.P$4 J3.P$6 J3.P$8 ; also sheet 6
ADCVDD: C21.1 U11.18(VDD) ; also sheet 6
GND: C21.2 R15.1 U11.9(VSS) ; also sheet 1,2,3,4,5,6,8,9
N$5: R4.2 U11.3(A2) U11.4(A1) U11.5(A0) U11.6(!RESET)
N$18: R15.2 U11.8(INT)
N$60: J3.P$1 U11.10(GP0)
N$61: J3.P$3 U11.12(GP2)
N$71: J3.P$5 U11.14(GP4)
N$72: J3.P$7 U11.16(GP6)
SCL: U11.1(SCL) ; also sheet 1,3,4,5,6,8,9
SDA: U11.2(SDA) ; also sheet 1,3,4,5,6,8,9
Unconnected: U11.7(NC) U11.11(GP1) U11.13(GP3) U11.15(GP5) U11.17(GP7)

### Notes on the sheet
- J4 on Z-World Board
  Pin 8 at 5.61, 1.73 in
- AD590 selector

## Sheet 8 of 9: Off-board interfaces
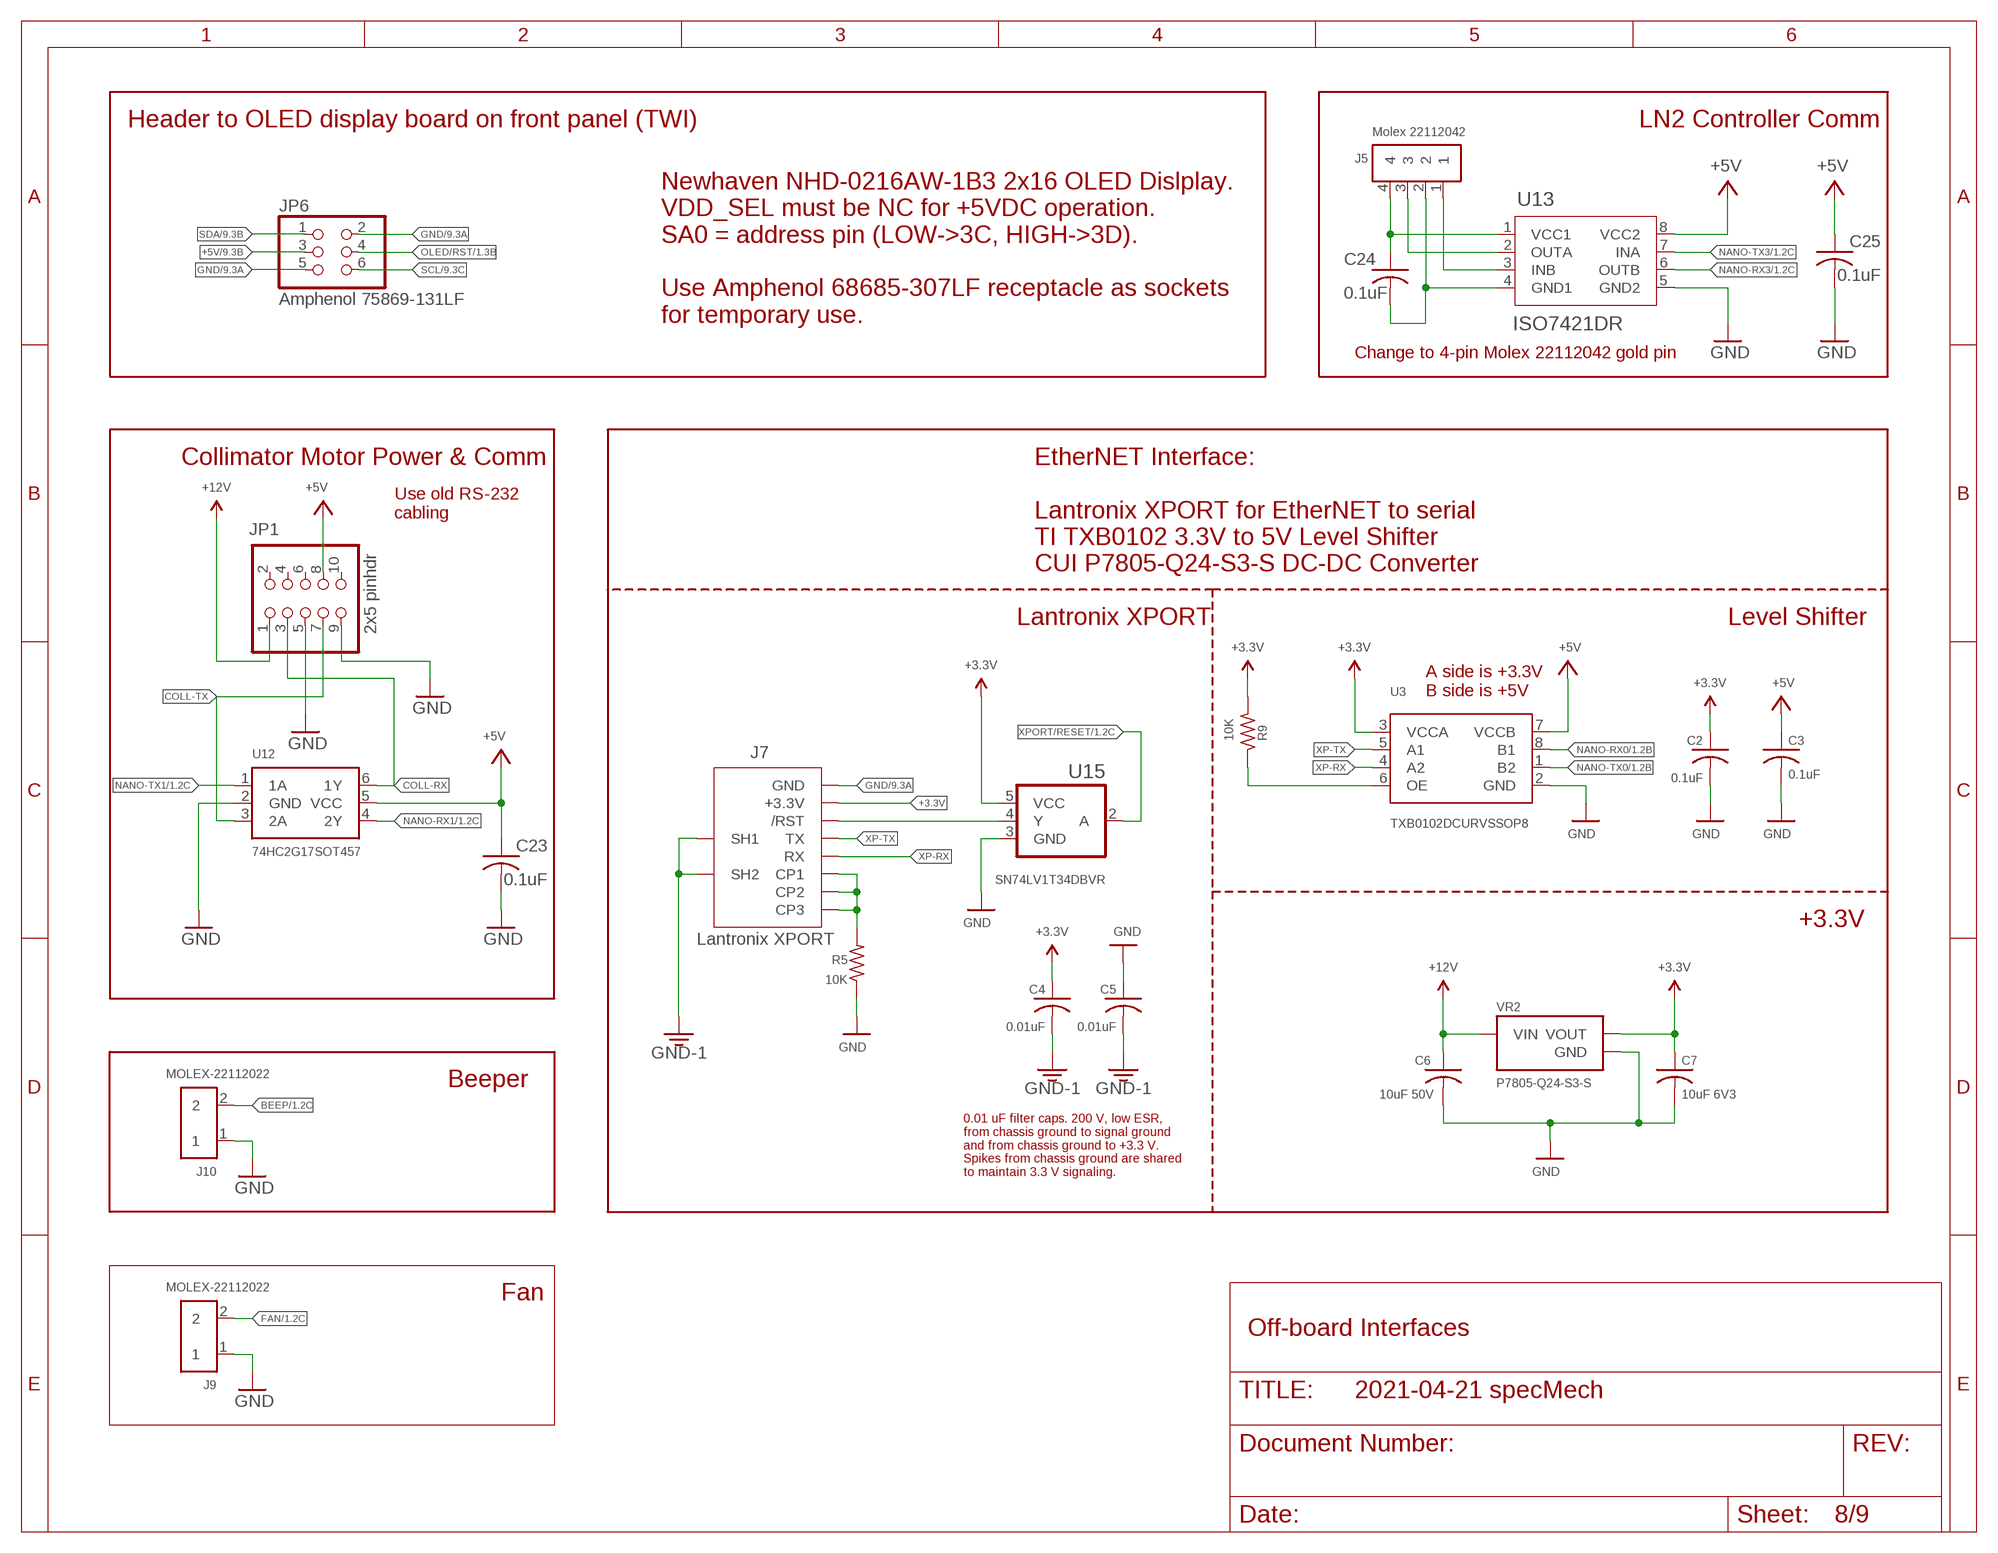
[diagram p7: schematic, sheet 8]

### Parts
C2  0.1uF  C-USC0805  [C0805]
C3  0.1uF  C-USC0805  [C0805]
C4  0.01uF  C-USC0805  [C0805]
C5  0.01uF  C-USC0805  [C0805]
C6  10uF 50V  C-USC1210  [C1210]
C7  10uF 6V3  C-USC0805  [C0805]
C23  0.1uF  C-USC0805  [C0805]
C24  0.1uF  C-USC0805  [C0805]
C25  0.1uF  C-USC0805  [C0805]
J5  Molex 22112042  PINHD-1X4-MOLEX-22112042  [1X04-MOLEX-22112042]
J7  Lantronix XPORT  XPORTXPORT-2  [XPORT-2]
J9  MOLEX-22112022  PINHD-1X2-MOLEX-22112022  [1X02-MOLEX-22112022]
J10  MOLEX-22112022  PINHD-1X2-MOLEX-22112022  [1X02-MOLEX-22112022]
JP1  2x5 pinhdr  PINHD-2X5  [2X05]
JP6  Amphenol 75869-131LF  PINHD-2X32X03/SHROUDED  [PINHD-2X3-SHROUDED]
R5  10K  R-US_R0805  [R0805]
R9  10K  R-US_R0805  [R0805]
U3  TXB0102DCURVSSOP8  [GHI-IC_VSSOP8(TI)]
U12  74HC2G17SOT457  [SOP95P275X110-6]
U13  ISO7421DR  ISO7421DRTI-SOIC-D8  [SOIC127P599X175-8N]
U15  SN74LV1T34DBVR  [SOT95P280X145-5N]
VR2  P7805-Q24-S3-S  [CONV_P7805-Q24-S3-S]

### Nets
+3.3V: C2.1 C4.1 C7.1 J7.3.3V(+3.3V) R9.2 U3.3(VCCA) U15.5(VCC) VR2.VOUT
+5V: C3.1 C23.1 C25.1 JP1.8 JP6.3 U3.7(VCCB) U12.5(VCC) U13.8(VCC2) ; also sheet 1,2,3,4,5,6,7,9
+12V: C6.1 JP1.1 VR2.VIN ; also sheet 2,5,9
BEEP: J10.2 ; also sheet 1
COLL-RX: JP1.3 U12.6(1Y)
COLL-TX: JP1.7 U12.3(2A)
CP3: J7.CP1 J7.CP2 J7.CP3 R5.2
FAN: J9.2 ; also sheet 1
GND: C2.2 C3.2 C5.1 C6.2 C7.2 C23.2 C25.2 J7.GND J9.1 J10.1 JP1.5 JP1.9 JP6.2 JP6.5 R5.1 U3.2(GND) U12.2(GND) U13.5(GND2) U15.3(GND) VR2.GND ; also sheet 1,2,3,4,5,6,7,9
GND-1: C4.2 C5.2 J7.P$1(SH1) J7.P$2(SH2)
N$8: C24.2 J5.2 U13.4(GND1)
N$19: J5.3 U13.2(OUTA)
N$23: J5.1 U13.3(INB)
N$25: C24.1 J5.4 U13.1(VCC1)
N$43: R9.1 U3.6(OE)
NANO-RX0: U3.8(B1) ; also sheet 1
NANO-RX1: U12.4(2Y) ; also sheet 1
NANO-RX3: U13.6(OUTB) ; also sheet 1
NANO-TX0: U3.1(B2) ; also sheet 1
NANO-TX1: U12.1(1A) ; also sheet 1
NANO-TX3: U13.7(INA) ; also sheet 1
OLED/RST: JP6.4 ; also sheet 1
SCL: JP6.6 ; also sheet 1,3,4,5,6,7,9
SDA: JP6.1 ; also sheet 1,3,4,5,6,7,9
XP-RX: J7.RX U3.4(A2)
XP-TX: J7.TX U3.5(A1)
XP/RST: J7./RST U15.4(Y)
XPORT/RESET: U15.2(A) ; also sheet 1
Unconnected: JP1.2 JP1.4 JP1.6 JP1.10

### Notes on the sheet
- Header to OLED display board on front panel (TWI) | LN2 Controller Comm
- Newhaven NHD-0216AW-1B3 2x16 OLED Dislplay.
  VDD_SEL must be NC for +5VDC operation.
  SA0 = address pin (LOW->3C, HIGH->3D).
  
  Use Amphenol 68685-307LF receptacle as sockets
  for temporary use.
- Change to 4-pin Molex 22112042 gold pin
- Collimator Motor Power & Comm
- Use old RS-232
  cabling
- EtherNET Interface:
  
  Lantronix XPORT for EtherNET to serial
  TI TXB0102 3.3V to 5V Level Shifter
  CUI P7805-Q24-S3-S DC-DC Converter
- Lantronix XPORT | Level Shifter
- A side is +3.3V
  B side is +5V
- +3.3V
- Beeper
- 0.01 uF filter caps. 200 V, low ESR,
  from chassis ground to signal ground
  and from chassis ground to +3.3 V.
  Spikes from chassis ground are shared
  to maintain 3.3 V signaling.
- Fan
- Off-board Interfaces

## Sheet 9 of 9
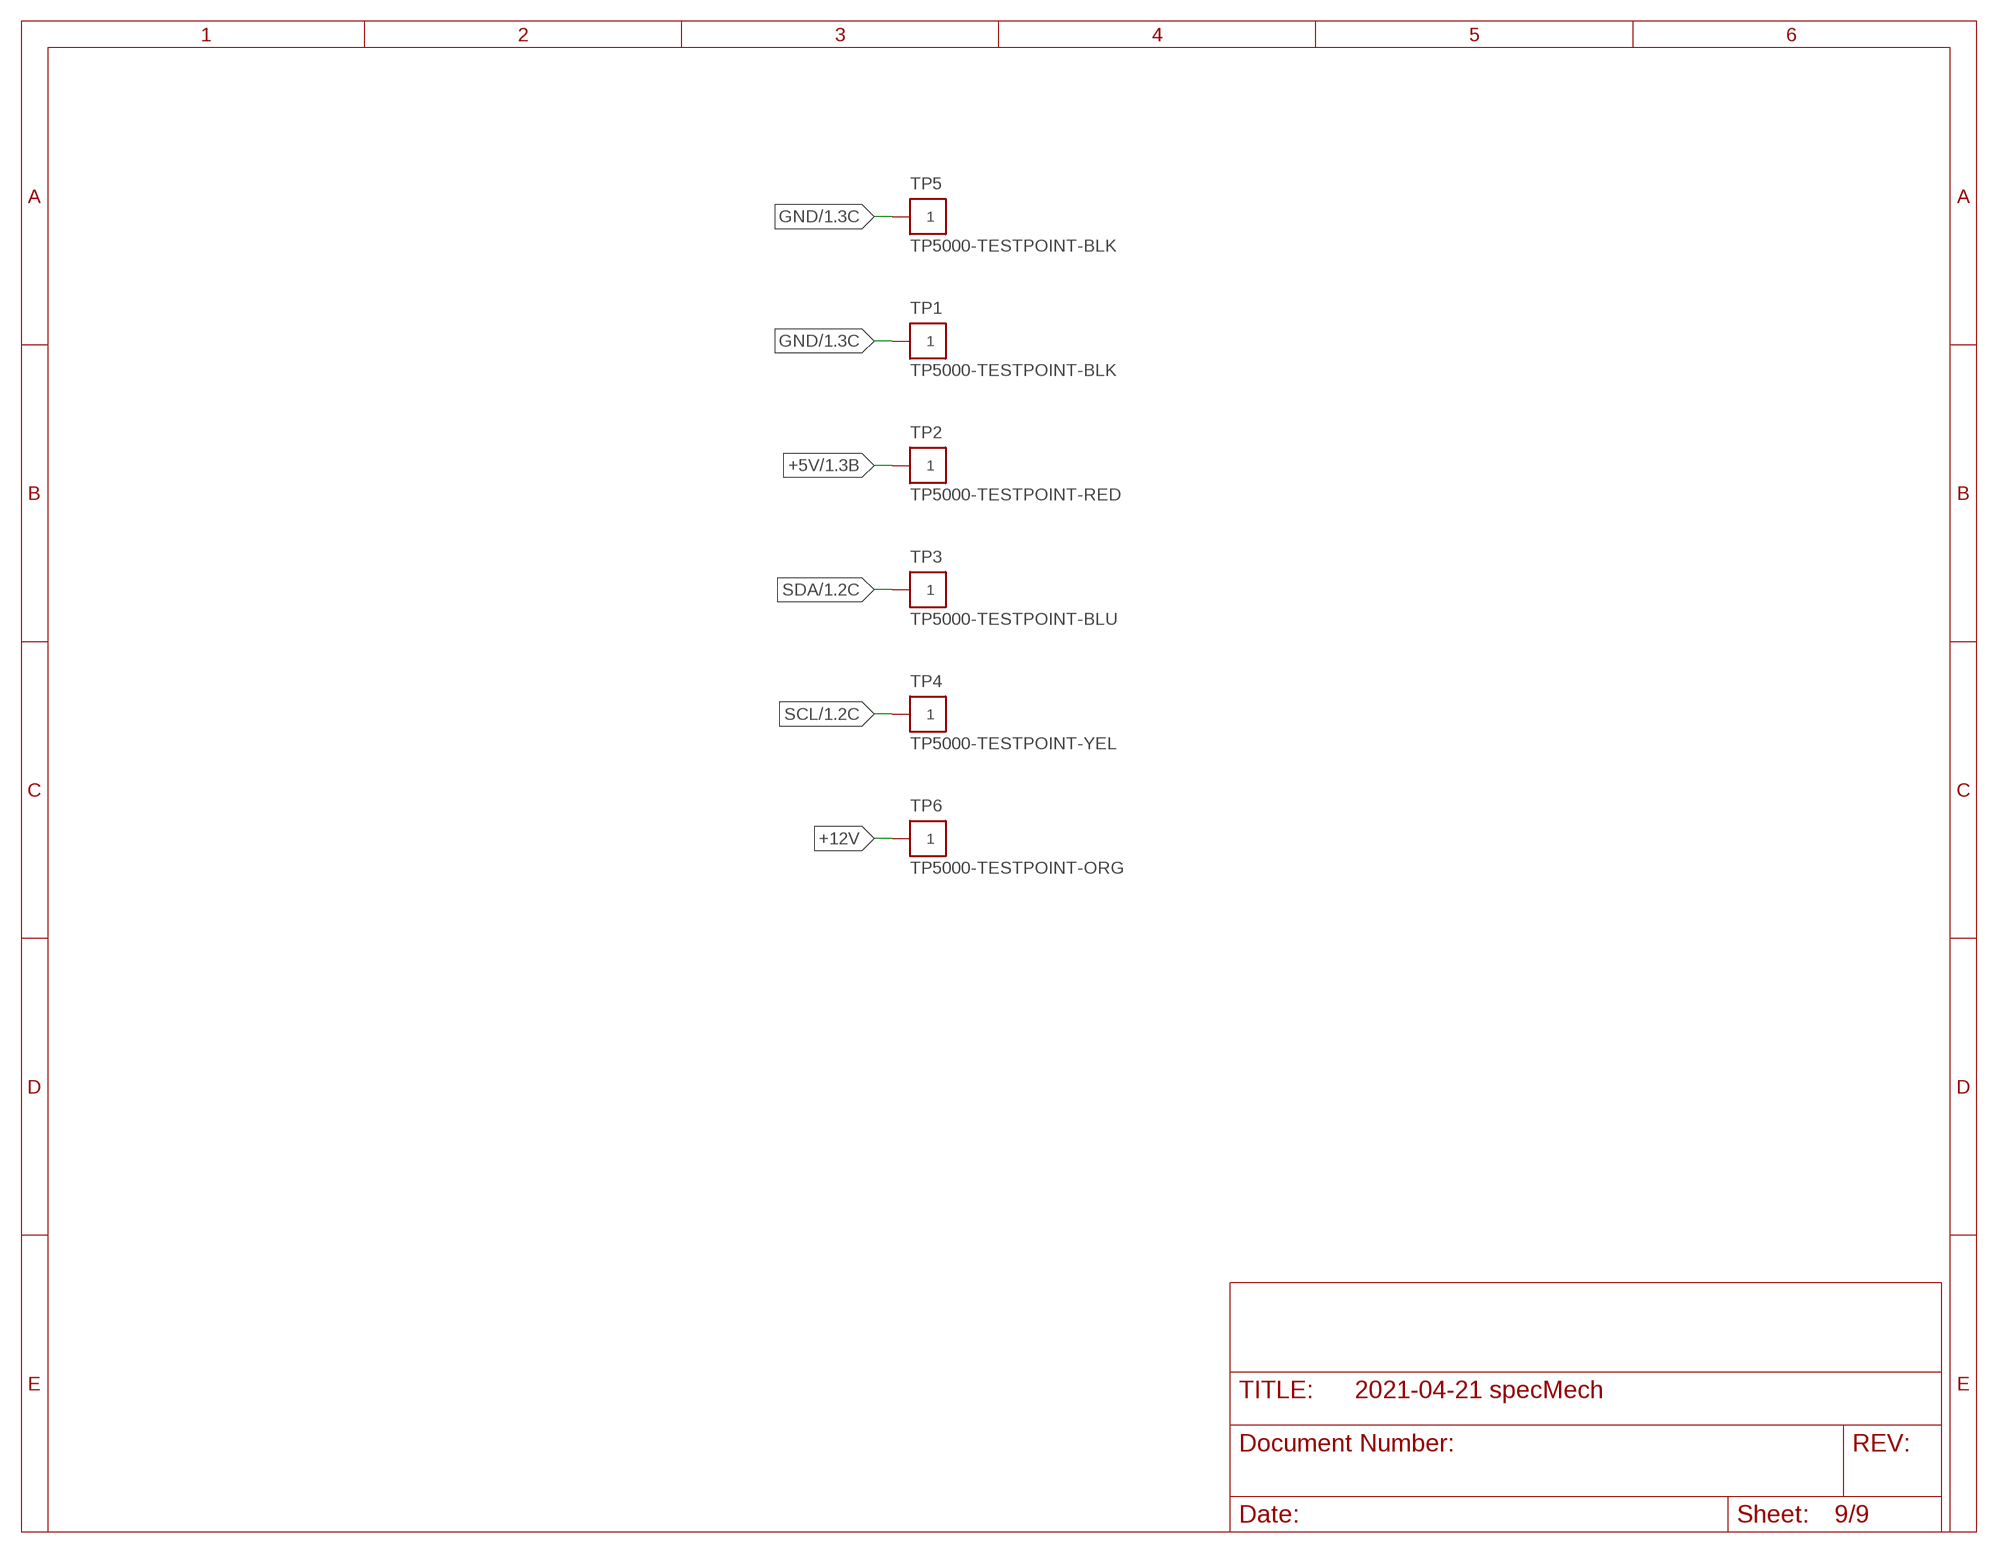
[diagram p8: schematic, sheet 9]

### Parts
TP1  TP5000-TESTPOINT-BLK  [TP5000-TESTPOINT-BLK]
TP2  TP5000-TESTPOINT-RED  [TP5000-TESTPOINT-RED]
TP3  TP5000-TESTPOINT-BLU  [TP5000-TESTPOINT-BLU]
TP4  TP5000-TESTPOINT-YEL  [TP5000-TESTPOINT-YEL]
TP5  TP5000-TESTPOINT-BLK  [TP5000-TESTPOINT-BLK]
TP6  TP5000-TESTPOINT-ORG  [TP5000-TESTPOINT-ORG]

### Nets
+5V: TP2.P$1 ; also sheet 1,2,3,4,5,6,7,8
+12V: TP6.P$1 ; also sheet 2,5,8
GND: TP1.P$1 TP5.P$1 ; also sheet 1,2,3,4,5,6,7,8
SCL: TP4.P$1 ; also sheet 1,3,4,5,6,7,8
SDA: TP3.P$1 ; also sheet 1,3,4,5,6,7,8

## Library data of the parts
BO1 = AUmlib:MMA8451BREAKOUT
BT1 = AUmlib:CR2032-BATT-BK-5058: BATTERY HOLDER COIN 20MM PC PIN; DESCRIPTION: Holder Coin Cell Batt Vert Mnt; MF: MPD (Memory; MP: BK-5058; PACKAGE: None; PURCHASE-URL: https://pricing.snapeda.com/search/part/BK-5058/?ref=eda
C1-C28 = AUmlib:C-US: CAPACITOR, American symbol; SPICEPREFIX: C
CNANO1 = AUmlib:CURIOSITYNANO4809
J1 J3 J4 J6 J8 = AUmlib:PINHD-1X8-MOLEX-SHROUD: 8-pin vertical header Molex 0022232081 tin plated version Digikey WM4206-ND $0.50 each 2020-09-15
J2 J9 J10 = AUmlib:PINHD-1X2-MOLEX-22112022
J5 = AUmlib:PINHD-1X4-MOLEX-22112042
J7 = AUmlib:XPORT
JP1 = AUmlib:PINHD-2X5: PIN HEADER
JP3 = AUmlib:PINHD-2X16: PIN HEADER
JP4 = AUmlib:PINHD-1X2: PIN HEADER
JP6 = AUmlib:PINHD-2X3: PIN HEADER
JP7 = AUmlib:PINHD-1X3: PIN HEADER
L1 = AUmlib:MMZ2012Y152BT000: FERRITE BEAD, 1.5 KOHM, 500mA, 0805 , FULL REEL; DESCRIPTION: 1.5 kOhms @ 100MHz 1 Signal Line Ferrite Bead 0805 (2012 Metric) 500mA 400mOhm; MF: TDK; MP: MMZ2012Y152BT000; PACKAGE: 0805 TDK; PURCHASE-URL: https://pricing.snapeda.com/search/part/MMZ2012Y152BT000/?ref=eda
PS1 = AUmlib:OKI-78SR-5/1.5-W36-C: OKI Series 8 W Single Output 5 V Non Isolated Through Hole DC/DC Converter; DESCRIPTION: Linear Regulator Replacement DC DC Converter 1 Output 5V 1.5A 7V - 36V Input; DIGI-KEY_PART_NUMBER: 811-2196-5-ND; MF: Murata Power Solutions Inc.; MP: OKI-78SR-5/1.5-W36-C; PACKAGE: SIP-3 Murata Power; PURCHASE-URL: https://pricing.snapeda.com/search/part/OKI-78SR-5/1.5-W36-C/?ref=eda
R1-R7 R9 R10 R12 R13 R15 R16 R22 R27 = AUmlib:R-US_: RESISTOR, American symbol; SPICEPREFIX: R
R11 R14 = AUmlib:4609X-101-103LF: Resistor array 8X bussed; MANUFACTURER_PART_NUMBER: 4609X101103LF; VENDOR: Bourns Electronics
RN1 RN2 = AUmlib:EXB-38V103JV: Res Thick Film Array 10K Ohm 5% ?200ppm/C ISOL Molded 8-Pin 1206(4 X 0603) Convex SMD Automotive T/R; DESCRIPTION: 10k Ohm ±5% 62.5mW Power Per Element Isolated Resistor Network/Array ±200ppm/°C 1206 (3216 Metric), Convex, Long Side Terminals; DIGI-KEY_PART_NUMBER: Y9103CT-ND; MF: Panasonic; MP: EXB-38V103JV; PACKAGE: 1206 Panasonic; PURCHASE-URL: https://pricing.snapeda.com/search/part/EXB-38V103JV/?ref=eda
TP1 TP5 = AUmlib:TP5000-TESTPOINT-BLK
TP2 = AUmlib:TP5000-TESTPOINT-RED
TP3 = AUmlib:TP5000-TESTPOINT-BLU
TP4 = AUmlib:TP5000-TESTPOINT-YEL
TP6 = AUmlib:TP5000-TESTPOINT-ORG
TVS1 TVS2 = AUmlib:TVS-QUAD-ESDA6V1BC6: Clamp Ipp Tvs Diode Surface Mount SOT-23-6; DESCRIPTION: Clamp Ipp Tvs Diode Surface Mount SOT-23-6; DIGI-KEY_PART_NUMBER: 497-6635-1-ND; MF: STMicroelectronics; MP: ESDA6V1BC6; PACKAGE: SOT-23-6 STMicroelectronics; PURCHASE-URL: https://pricing.snapeda.com/search/part/ESDA6V1BC6/?ref=eda
U1 U2 U8 U11 = AUmlib:MCP23008-E/SO; BUILT_BY: EMA_UL_Team; MANUFACTURER_PART_NUMBER: MCP23008-E/SO; VENDOR: Microchip
U3 = AUmlib:TXB0102DCUR: Bidirectional voltage level translator. Digikey 296-22862-1-ND $0.71 each 2020-10-19
U4 = AUmlib:MCP9808-E/MS; BUILT_BY: EMA_UL_Team; MANUFACTURER_PART_NUMBER: MCP9808-E/MS; SOURCELIBRARY: Microchip_2014-11-20; VENDOR: Microchip
U5 = AUmlib:TBD62083: Toshiba TBD62083 high current driver, ULN2308 replacement
U6 = AUmlib:DS3231MZ+; BUILT_BY: EMA_UL_Team; MANUFACTURER_PART_NUMBER: DS3231MZ+; VENDOR: Maxim Integrated Products
U7 = AUmlib:LTC4311ISC6TRPBF; BUILT_BY: EMA_UL_Team; MANUFACTURER_PART_NUMBER: ltc4311isc6#trpbf; SOURCELIBRARY: LinearTech_2016_03_08; VENDOR: Linear Technology
U9 U10 = AUmlib:ADS1115IDGSR: ADS1115 16-bit ADC with I2C communications
U12 = AUmlib:74HC2G17: Dual Schmitt Trigger
U13 = AUmlib:ISO7421DR: ISO7421 Dual channel digital isolator.
U14 = AUmlib:MB85RC512: MB85RC512 I2C FRAM
U15 = AUmlib:SN74LV1T34DBVR; DESCRIPTION: Single Power Supply BUFFER Logic Level Shifter (no enable) 5-SOT-23 -40 to 125; DIGI-KEY_PART_NUMBER: 296-37176-1-ND; MF: Texas Instruments; MP: SN74LV1T34DBVR; PACKAGE: SOT-23-5 Texas Instruments; PURCHASE-URL: https://pricing.snapeda.com/search/part/SN74LV1T34DBVR/?ref=eda
VR2 = AUmlib:P7805-Q24-S3-S: CUI P7805-Q24-S3-S DC-DC Converter 3.3V 2W Digikey 102-2704-ND $4.94 2020-09-14; AVAILABILITY: Good; DESCRIPTION: 3.3V 2W; MF: CUI; MP: P7805-Q12-S1R5-S; PACKAGE: SIP-3 CUI; PRICE: $4.94

## Board
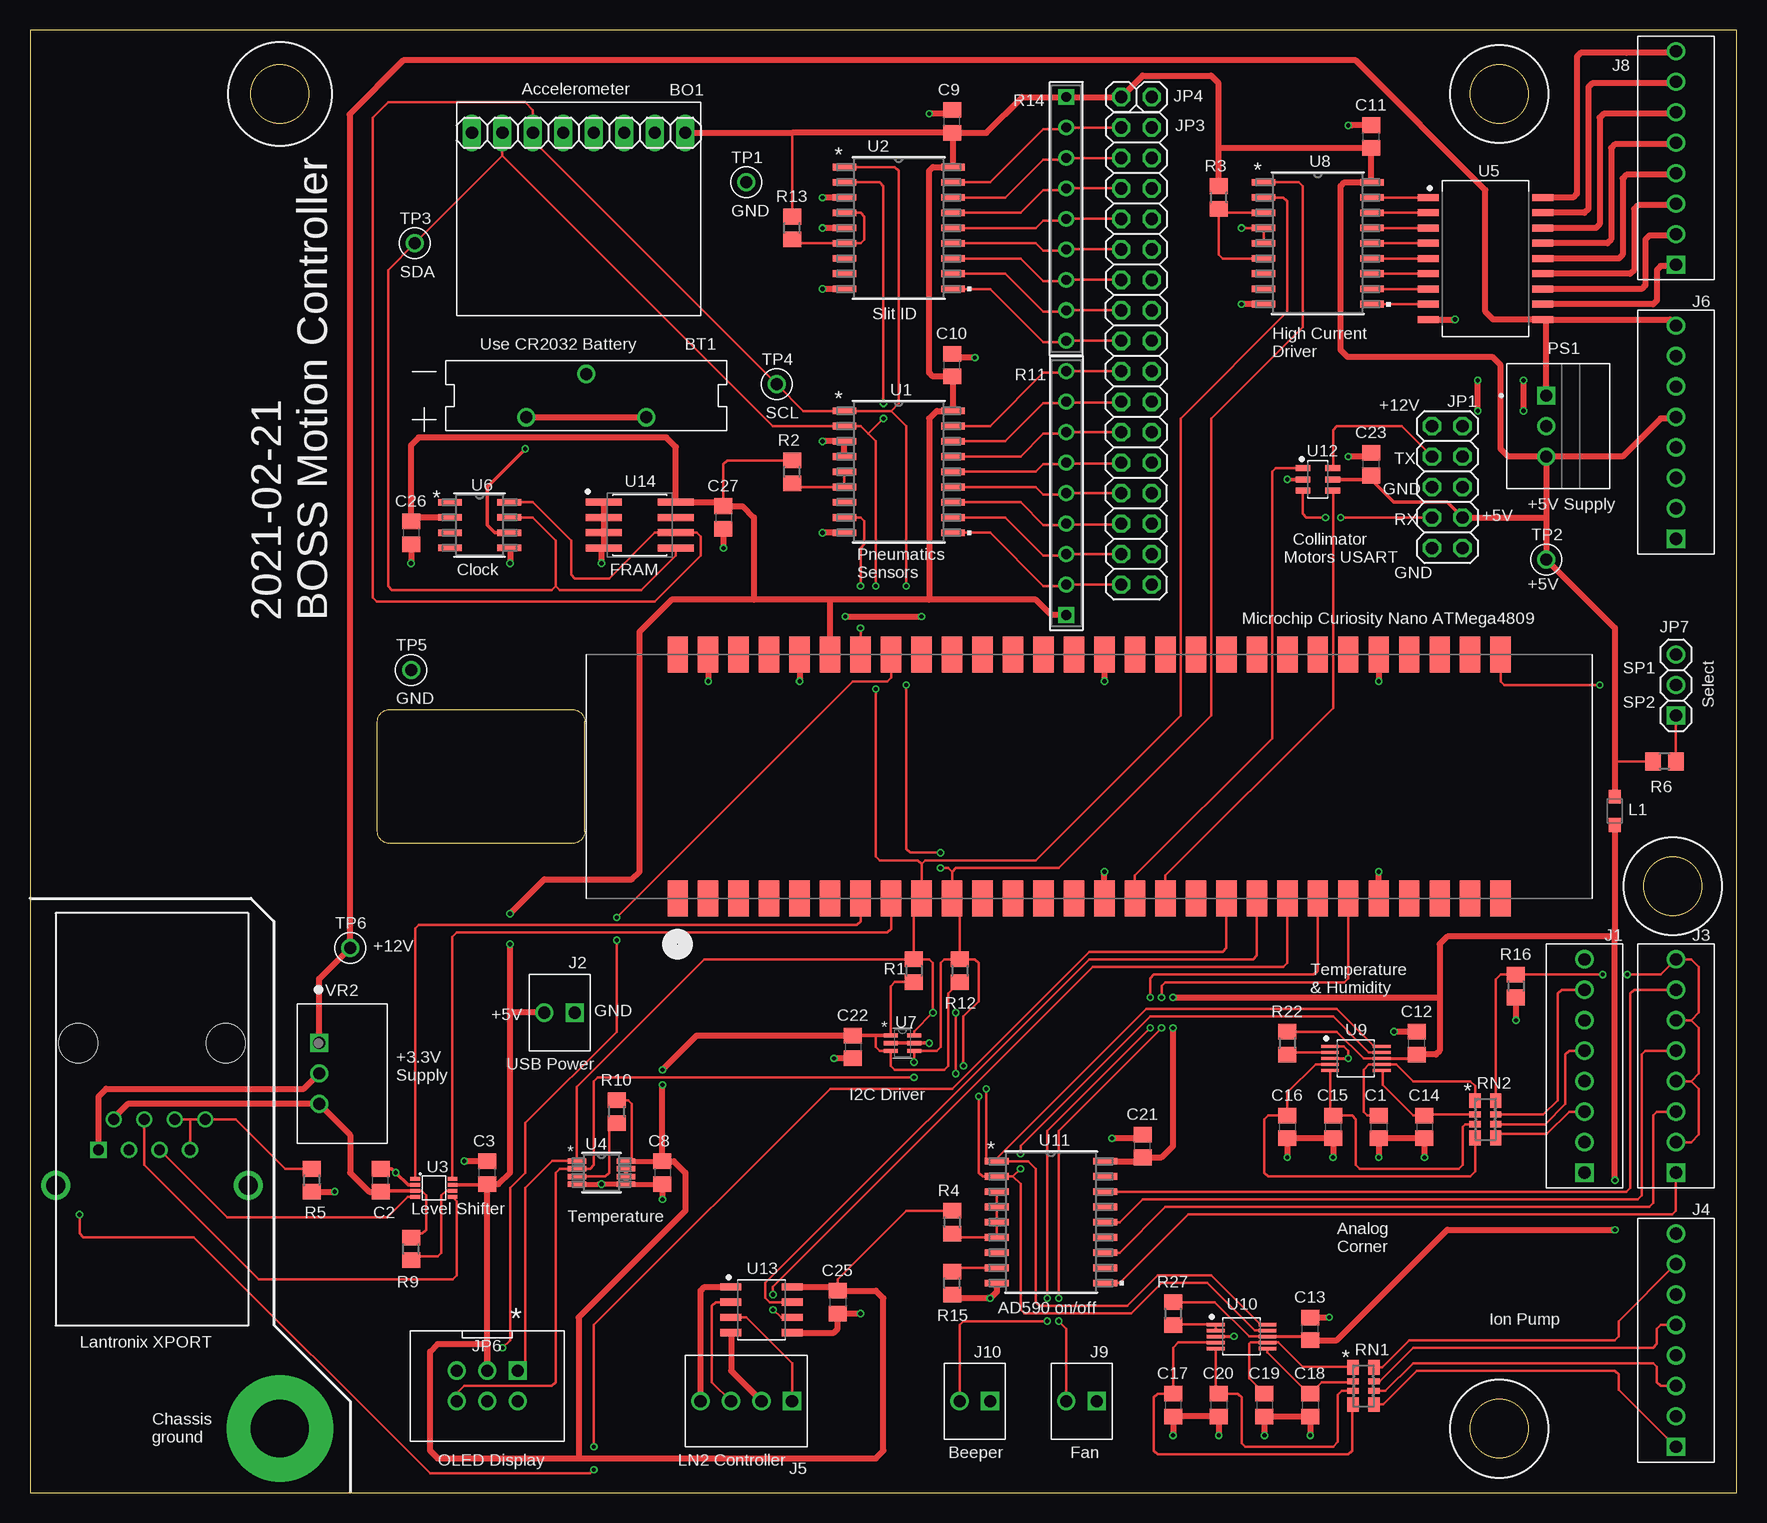
[diagram p9: board, top side]
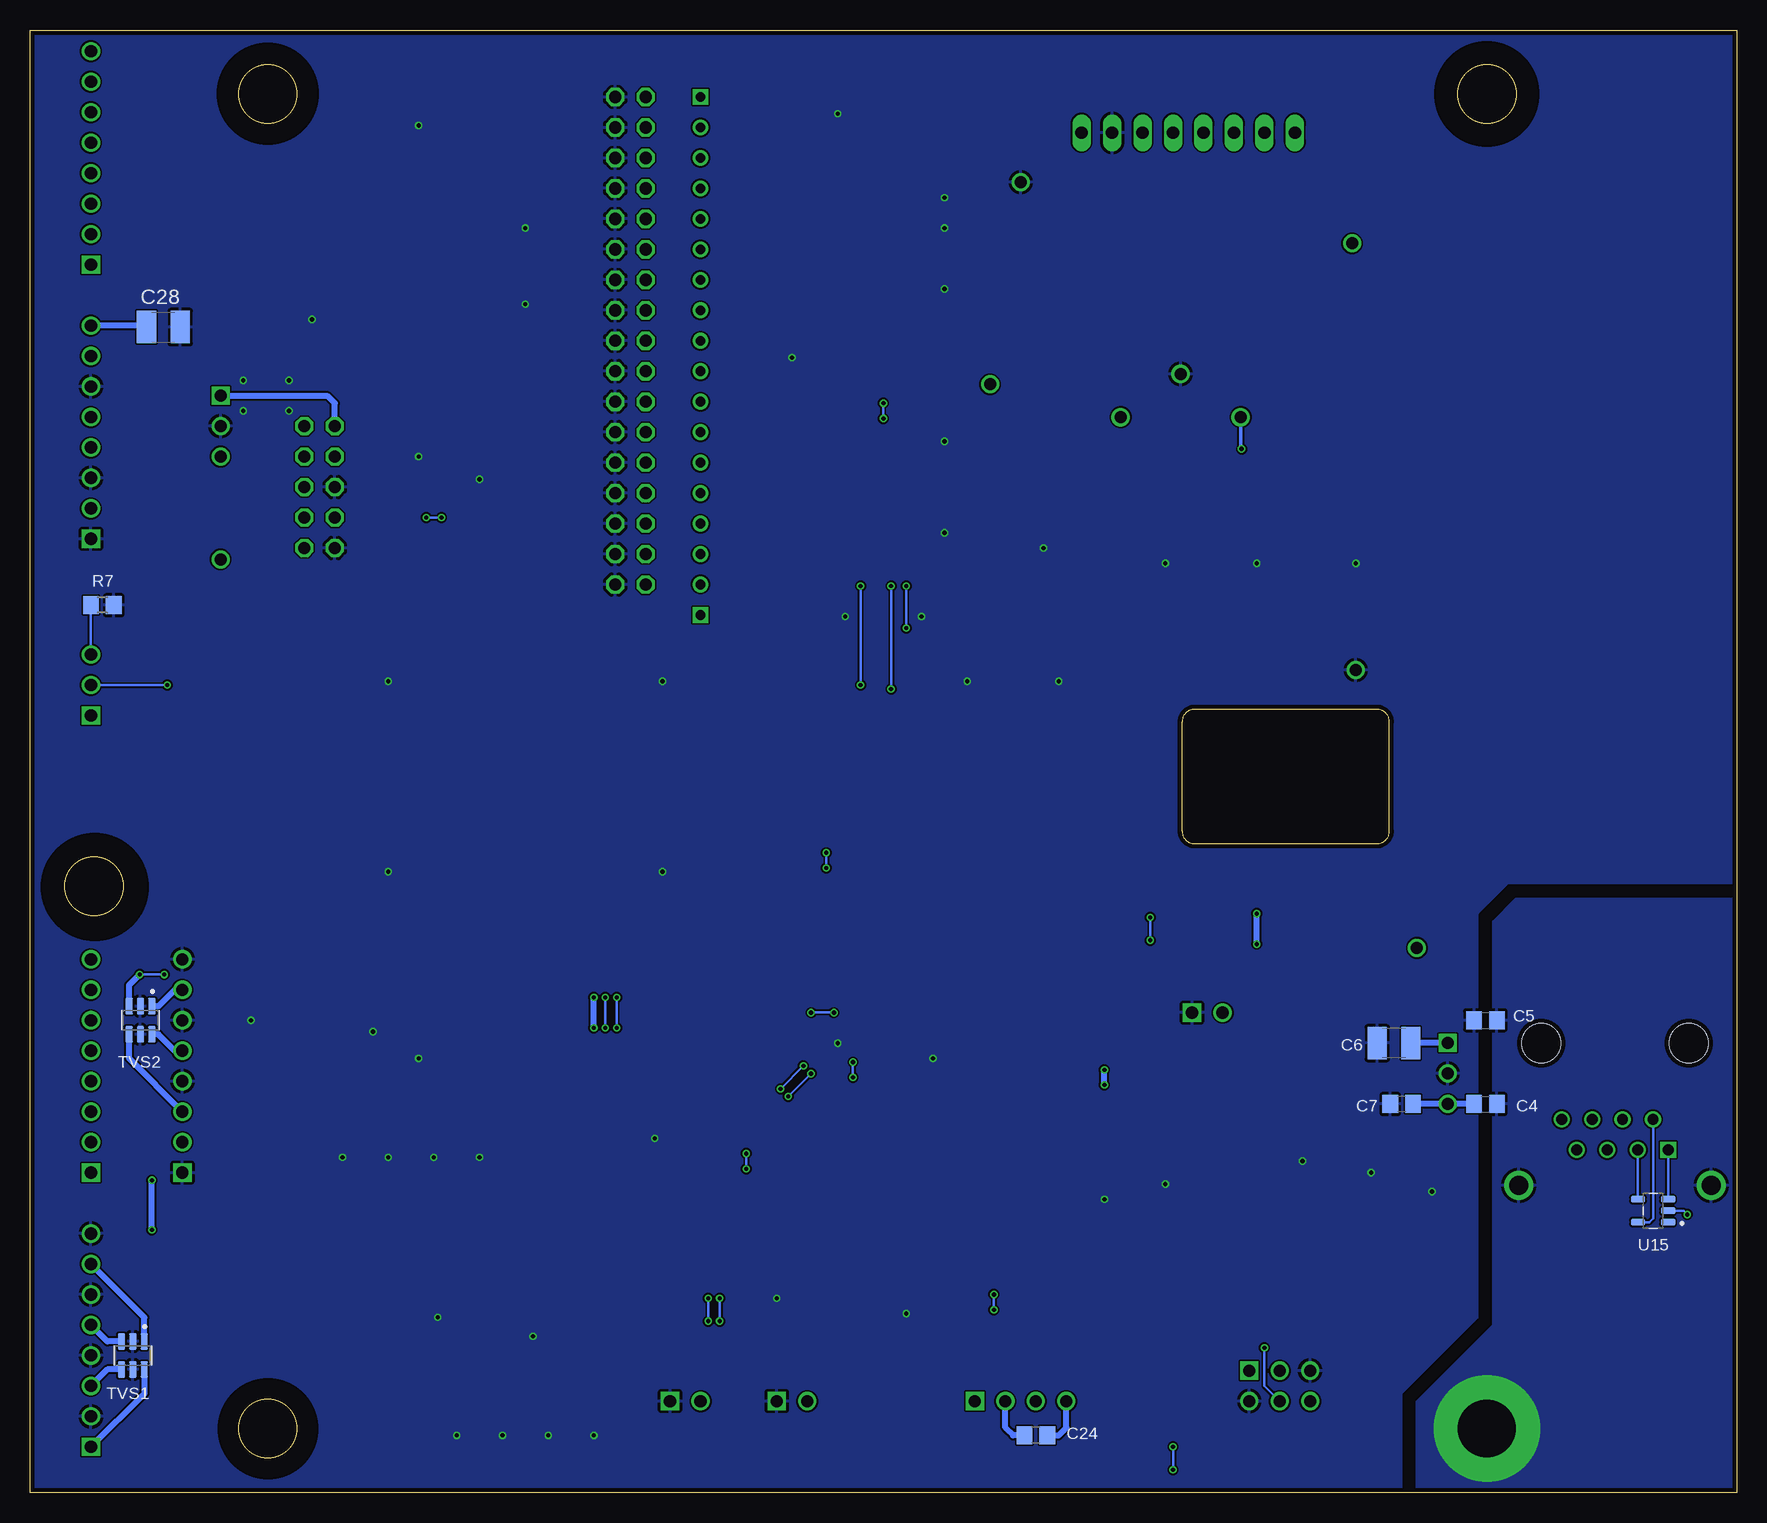
[diagram p10: board, bottom side, seen from below]

Size 142.24 x 121.92 mm. Coordinates in mm from the lower left corner, seen from the top.
Outline: 0,121.92 0,0 142.24,0 142.24,121.92 0,121.92
Outline: 46.23,55.12 46.23,64.26 arc90 45.21,65.28 29.97,65.28 arc90 28.96,64.26 28.96,55.12 arc90 29.97,54.1 45.21,54.1 arc90 46.23,55.12
Outline: circle at 122.43,5.33 radius 2.41
Outline: circle at 20.83,116.59 radius 2.41
Outline: circle at 136.91,50.55 radius 2.41
Outline: circle at 122.43,116.59 radius 2.41
Copper layers (1*16): Top 0.035559375mm / dielectric 1.6mm / Bottom 0.035559375mm
Design rules "oshpark-2layer *": minimum track width 6mil, minimum drill 10mil, track to track 6mil, track to pad 6mil, pad to pad 6mil, via to via 6mil, smd to smd 6mil, copper to edge 15mil, drill to drill 6mil, minimum pad ring 5mil, minimum via ring 5mil, stop-mask expansion 2.5mil, vias tented up to drill 0mil, thermal gap 10mil
Holes 4.83 mm at 122.43,5.33 136.91,50.55 122.43,116.59 20.83,116.59
tKeepout: area 16,0.5 to 25.7,10.2
bKeepout: area 16,0.5 to 25.7,10.2
bRestrict: area 132.4,46.1 to 141.3,54.9; area 118.3,1.2 to 126.5,9.4; area 16.6,112.3 to 25.1,120.9; area 118.3,112.5 to 126.6,120.8

### Footprints (pad centres in the part's own frame; a part is rotated, then mirrored left to right if it is on the bottom)
1X08 = drill 1.016 long: 1 8.89,-6.35; 2 6.35,-6.35; 3 3.81,-6.35; 4 1.27,-6.35; 5 -1.27,-6.35; 6 -3.81,-6.35; 7 -6.35,-6.35; 8 -8.89,-6.35
BAT_BK-5058 = drill 1.02: - 0,1.8; S+1 -5,-1.8; S+2 5,-1.8
C0805 = smd 1.3 x 1.5: 1 -0.95,0; 2 0.95,0
C1210 = smd 1.6 x 2.7: 1 -1.4,0; 2 1.4,0
CURIOSITYNANO4809CASTELLATED = smd 3 x 1.7: GND15 -10.16,-1.27; GND24 -10.16,-24.13; GND33 10.16,-24.13; GND42 10.16,-1.27; GND52 10.16,24.13; ID -10.16,31.75; NC -10.16,34.29; PA0-TX -10.16,19.05; PA1-RX -10.16,16.51; PA2-SDA -10.16,13.97; PA3-SCL -10.16,11.43; PA4-MOSI -10.16,8.89; PA5-MISO -10.16,6.35; PA6-SCK -10.16,3.81; PA7-SS -10.16,1.27; PB0-RX -10.16,29.21; PB0-TX -10.16,-13.97; PB1-RX -10.16,-16.51; PB1-TX -10.16,26.67; PB2 -10.16,-19.05; PB3 -10.16,-21.59; PB4 10.16,-21.59; PB5 10.16,-19.05; PC0-TX -10.16,-3.81; PC1-RX -10.16,-6.35; PC2 -10.16,-8.89; PC3 -10.16,-11.43; PC4 10.16,-11.43; PC5 10.16,-8.89; PC6 10.16,-6.35; PC7 10.16,-3.81; PD0-AIN0 10.16,1.27; PD1-AIN1 10.16,3.81; PD2-AIN2 10.16,6.35; PD3-AIN3 10.16,8.89; PD4-AIN4 10.16,11.43; PD5-AIN5 10.16,13.97; PD6-AIN6 10.16,16.51; PD7-AIN7 10.16,19.05; PE0 -10.16,-26.67; PE1 -10.16,-29.21; PE2 -10.16,-31.75; PE3 -10.16,-34.29; PF0-TOSC1 10.16,-16.51; PF1-TOSC2 10.16,-13.97; PF2 10.16,-34.29; PF2-6 -10.16,21.59; PF3 10.16,-31.75; PF3-5 -10.16,24.13; PF4 10.16,-29.21; PF5-LED 10.16,-26.67; PF6-SW0 10.16,29.21; UPDI 10.16,26.67; VBUS 10.16,34.29; VOFF 10.16,31.75; VTG 10.16,21.59
1X08-MOLEX-SHROUD = drill 1.016 square: P$1 0,8.89 | drill 1.016: P$2 0,6.35; P$3 0,3.81; P$4 0,1.27; P$5 0,-1.27; P$6 0,-3.81; P$7 0,-6.35; P$8 0,-8.89
1X02-MOLEX-22112022 = drill 1.016 square: 1 -1.27,0 | drill 1.016: 2 1.27,0
1X04-MOLEX-22112042 = drill 1.016 square: 1 0,0 | drill 1.016: 2 2.54,0; 3 5.08,0; 4 7.62,0
XPORT-2 = drill 0.9: 3.3V 0,-3.175; /RST 2.54,-1.905; CP1 0,1.905; CP2 2.54,3.175; CP3 0,4.445; RX 2.54,0.635; TX 0,-0.635 | drill 0.9 square: GND 2.54,-4.445 | drill 1.6: P$1 5.5,8.025; P$2 5.5,-8.025 | hole 3.25: -6.35,6.15; -6.35,-6.15
2X05 = drill 1.016 octagon: 1 -5.08,-1.27; 2 -5.08,1.27; 3 -2.54,-1.27; 4 -2.54,1.27; 5 0,-1.27; 6 0,1.27; 7 2.54,-1.27; 8 2.54,1.27; 9 5.08,-1.27; 10 5.08,1.27
2X16 = drill 1.016 octagon: 1 -19.05,-1.27; 2 -19.05,1.27; 3 -16.51,-1.27; 4 -16.51,1.27; 5 -13.97,-1.27; 6 -13.97,1.27; 7 -11.43,-1.27; 8 -11.43,1.27; 9 -8.89,-1.27; 10 -8.89,1.27; 11 -6.35,-1.27; 12 -6.35,1.27; 13 -3.81,-1.27; 14 -3.81,1.27; 15 -1.27,-1.27; 16 -1.27,1.27; 17 1.27,-1.27; 18 1.27,1.27; 19 3.81,-1.27; 20 3.81,1.27; 21 6.35,-1.27; 22 6.35,1.27; 23 8.89,-1.27; 24 8.89,1.27; 25 11.43,-1.27; 26 11.43,1.27; 27 13.97,-1.27; 28 13.97,1.27; 29 16.51,-1.27; 30 16.51,1.27; 31 19.05,-1.27; 32 19.05,1.27
1X02 = drill 1.016 octagon: 1 -1.27,0; 2 1.27,0
PINHD-2X3-SHROUDED = drill 1.016 square: 1 -2.54,-1.27 | drill 1.016: 2 -2.54,1.27; 3 0,-1.27; 4 0,1.27; 5 2.54,-1.27; 6 2.54,1.27
1X03 = drill 1.016 square: 1 -2.54,0 | drill 1.016: 2 0,0; 3 2.54,0
INDC2012X87N = smd 1.15 x 1: 1 -1.175,0; 2 1.175,0
CONV_OKI-78SR-5/1.5-W36-C = drill 1 pad 1.5 square: 1 -2.54,0 | drill 1 pad 1.5: 2 0,0; 3 2.54,0
R0805 = smd 1.3 x 1.5: 1 -0.95,0; 2 0.95,0
BO_4609X = drill 0.813 pad 1.321 square: 1 0,0 | drill 0.813 pad 1.321: 2 2.54,0; 3 5.08,0; 4 7.62,0; 5 10.16,0; 6 12.7,0; 7 15.24,0; 8 17.78,0; 9 20.32,0
EXB38V_PAN = smd 0.94 x 1.219: 1 -0.864,1.549; 4 -0.864,-1.549; 5 0.864,-1.549; 8 0.864,1.549 | smd 0.94 x 0.508: 2 -0.864,0.394; 3 -0.864,-0.406; 6 0.864,-0.406; 7 0.864,0.394
TP5000-TESTPOINT-BLK = drill 1: P$1 0,0
TP5000-TESTPOINT-RED = drill 1: P$1 0,0
TP5000-TESTPOINT-BLU = drill 1: P$1 0,0
TP5000-TESTPOINT-YEL = drill 1: P$1 0,0
TP5000-TESTPOINT-ORG = drill 1: P$1 0,0
SOT95P280X145-6N = smd 1.36 x 0.6: 1 -1.175,0.95; 2 -1.175,0; 3 -1.175,-0.95; 4 1.175,-0.95; 5 1.175,0; 6 1.175,0.95
SOIC18-W_MC = smd 1.981 x 0.559: 1 -4.521,5.08; 2 -4.521,3.81; 3 -4.521,2.54; 4 -4.521,1.27; 5 -4.521,0; 6 -4.521,-1.27; 7 -4.521,-2.54; 8 -4.521,-3.81; 9 -4.521,-5.08; 10 4.521,-5.08; 11 4.521,-3.81; 12 4.521,-2.54; 13 4.521,-1.27; 14 4.521,0; 15 4.521,1.27; 16 4.521,2.54; 17 4.521,3.81; 18 4.521,5.08
GHI-IC_VSSOP8(TI) = smd 0.8 x 0.3: 1 -1.55,0.75; 2 -1.55,0.25; 3 -1.55,-0.25; 4 -1.55,-0.75; 5 1.55,-0.75; 6 1.55,-0.25; 7 1.55,0.25; 8 1.55,0.75
MSOP8_MC_MCH = smd 1.524 x 0.457: 1 -2.045,0.975; 2 -2.045,0.325; 3 -2.045,-0.325; 4 -2.045,-0.975; 5 2.045,-0.975; 6 2.045,-0.325; 7 2.045,0.325; 8 2.045,0.975
SOIC127P1030X245-18 = smd 1.765 x 0.589: 1 -4.773,5.08; 2 -4.773,3.81; 3 -4.773,2.54; 4 -4.773,1.27; 5 -4.773,0; 6 -4.773,-1.27; 7 -4.773,-2.54; 8 -4.773,-3.81; 9 -4.773,-5.08; 10 4.773,-5.08; 11 4.773,-3.81; 12 4.773,-2.54; 13 4.773,-1.27; 14 4.773,0; 15 4.773,1.27; 16 4.773,2.54; 17 4.773,3.81; 18 4.773,5.08
21-0041B_8 = smd 1.981 x 0.533: 1 -2.464,1.905; 2 -2.464,0.635; 3 -2.464,-0.635; 4 -2.464,-1.905; 5 2.464,-1.905; 6 2.464,-0.635; 7 2.464,0.635; 8 2.464,1.905
SOT-6_SC_LIT = smd 1.171 x 0.351: 1 -0.97,0.65; 2 -0.97,0; 3 -0.97,-0.65; 4 0.97,-0.65; 5 0.97,0; 6 0.97,0.65
SOP50P490X110-10N = smd 1.471 x 0.28: 1 -2.15,1; 2 -2.15,0.5; 3 -2.15,0; 4 -2.15,-0.5; 5 -2.15,-1; 6 2.15,-1; 7 2.15,-0.5; 8 2.15,0; 9 2.15,0.5; 10 2.15,1
SOP95P275X110-6 = smd 1.224 x 0.497: 1 -1.244,0.95; 2 -1.244,0; 3 -1.244,-0.95; 4 1.244,-0.95; 5 1.244,0; 6 1.244,0.95
SOIC127P599X175-8N = smd 1.751 x 0.599: 1 -2.578,1.905; 2 -2.578,0.635; 3 -2.578,-0.635; 4 -2.578,-1.905; 5 2.578,-1.905; 6 2.578,-0.635; 7 2.578,0.635; 8 2.578,1.905
SOIC127P797X210-8N = smd 3 x 0.59: 1 -3.003,1.905; 2 -3.003,0.635; 3 -3.003,-0.635; 4 -3.003,-1.905; 5 3.014,-1.905; 6 3.014,-0.635; 7 3.014,0.635; 8 3.014,1.905
SOT95P280X145-5N = smd 1.21 x 0.59: 1 -1.255,0.95; 2 -1.255,0; 3 -1.255,-0.95; 4 1.255,-0.95; 5 1.255,0.95
CONV_P7805-Q24-S3-S = drill 1: GND 0,-1.95; VOUT 2.54,-1.95 | drill 1 square: VIN -2.54,-1.95

### Placement (x,y rotation side)
BO1  45.72,107 180 top
BT1  46.35,91.44 0 top
C1  112.39,30.48 270 top
C2  29.21,26.04 90 top
C3  38.1,26.67 90 top
C4  20.95,32.38 0 bottom
C5  20.95,39.37 0 bottom
C6  28.57,37.47 180 bottom
C7  27.94,32.38 180 bottom
C8  52.7,26.67 270 top
C9  76.83,114.3 90 top
C10  76.83,93.98 90 top
C11  111.76,113.03 90 top
C12  115.57,37.47 90 top
C13  106.68,13.65 90 top
C14  116.2,30.48 270 top
C15  108.58,30.48 270 top
C16  104.78,30.48 270 top
C17  95.25,7.3 270 top
C18  106.68,7.3 270 top
C19  102.87,7.3 270 top
C20  99.06,7.3 270 top
C21  92.71,28.89 90 top
C22  68.58,37.15 270 top
C23  111.76,85.72 90 top
C24  58.42,4.76 180 bottom
C25  67.31,15.88 270 top
C26  31.75,80.01 270 top
C27  57.78,81.28 270 top
C28  131.13,97.16 0 bottom
CNANO1  88.27,59.69 90 top
J1  129.54,35.56 180 top
J2  44.13,40.01 180 top
J3  137.16,35.56 180 top
J4  137.16,12.7 180 top
J5  63.5,7.62 180 top
J6  137.16,88.39 180 top
J7  10.16,31.11 270 top
J8  137.16,111.25 180 top
J9  87.63,7.62 180 top
J10  78.74,7.62 180 top
JP1  118.11,83.82 270 top
JP3  92.2,94.74 270 top
JP4  92.2,116.33 0 top
JP6  38.1,8.89 180 top
JP7  137.16,67.31 90 top
L1  132.08,56.83 90 top
PS1  126.36,88.9 270 top
R1  73.66,43.5 270 top
R2  63.5,85.09 90 top
R3  99.06,107.95 90 top
R4  76.83,22.54 270 top
R5  23.5,26.04 90 top
R6  136.21,60.96 180 top
R7  136.21,73.98 180 bottom
R9  31.75,20.32 90 top
R10  48.9,31.75 90 top
R11  86.36,73.15 90 top
R12  77.47,43.5 270 top
R13  63.5,105.41 90 top
R14  86.36,116.33 270 top
R15  76.83,17.46 90 top
R16  123.83,42.23 270 top
R22  104.78,37.47 270 top
R27  95.25,14.92 270 top
RN1  111.12,8.89 0 top
RN2  121.28,31.11 0 top
TP1  59.69,109.22 0 top
TP2  126.36,77.79 0 top
TP3  32.07,104.14 0 top
TP4  62.23,92.39 0 top
TP5  31.75,68.58 0 top
TP6  26.67,45.4 0 top
TVS1  133.67,11.43 270 bottom
TVS2  133.03,39.37 270 bottom
U1  72.39,85.09 0 top
U2  72.39,105.41 0 top
U3  33.66,25.4 0 top
U4  47.62,26.67 0 top
U5  121.28,102.87 0 top
U6  37.47,80.64 0 top
U7  72.71,37.47 0 top
U8  107.31,104.14 0 top
U9  110.49,36.2 0 top
U10  100.97,13.02 0 top
U11  85.09,22.54 0 top
U12  107.31,84.45 0 top
U13  60.96,15.24 0 top
U14  50.8,80.64 0 top
U15  6.99,23.5 180 bottom
VR2  26.04,34.92 270 top

### Tracks (layer width: path | path; a pad name or v marks a point on that pad's centre or on a via)
+3.3V
  Top 0.203: R9.2 32.07,21.59 32.7,21.59 33.02,21.91 33.02,24.77 32.63,25.15 U3.3
  Top 0.305: U3.3 29.27,25.15 C2.1
  Top 0.508: C2.1 28.25,25.09 26.67,26.67 26.67,29.8 VR2.VOUT 8.13,32.38 6.99,31.24 J7.3.3V
  Bottom 0.203: J7.3.3V 6.99,22.86 7.3,22.54 U15.5
  Bottom 0.508: C4.1 VR2.VOUT C7.1
+5V  (via drill 0.35)
  Top 0.203: R10.2 49.85,32.7 50.16,32.38 50.16,27.62 | C27.1 57.78,85.72 58.1,86.04 R2.2 | R13.2 63.5,113.35 | U7.1 71.74,42.21 72.08,42.55 R1.2 | 70.48,38.12 70.48,37.15 70.82,36.81 U7.3 71.74,35.58 72.07,35.24 76.2,35.24 76.52,35.56 76.52,41.59 R12.2 | C25.1 67.31,17.78 73.03,23.5 R4.1 | R6.2 132.08,60.96
  Top 0.305: U12.5 111.76,84.45 113.67,82.55 118.11,82.55 JP1.8 | U3.7 38.03,25.65 C3.1 | U7.1 70.48,38.12 68.6,38.12 C22.1
  Top 0.406: U4.8 49.7,27.62 50.16,27.62 C8.1
  Top 0.508: J6.P$5 137.03,89.53 135.89,89.53 132.72,86.36 PS1.3 | 111.76,84.45 C23.1 | C9.1 76.91,113.27 U2.18 75.25,110.49 74.93,110.17 74.93,93.34 75.25,93.03 C10.1 76.91,92.95 U1.18 75.56,90.17 74.93,89.53 74.93,74.42 | C9.1 79.69,113.35 82.68,116.33 R14.1 JP4.1 92.71,118.11 98.42,118.11 99.06,117.47 99.06,112.08 | U6.2 31.75,81.28 C26.1 31.75,87.31 32.38,87.95 53.02,87.95 53.81,87.16 U14.8 57.47,82.55 C27.1 59.38,82.23 60.33,81.28 60.33,74.42 | C9.1 63.5,113.35 BO1.8 | PS1.3 123.19,86.36 122.56,87 122.56,93.98 121.85,94.69 109.78,94.69 109.22,95.25 109.22,108.9 109.54,109.22 U8.18 111.76,109.3 C11.1 99.06,112.08 | 40.01,40.01 40.01,26.67 39.05,25.72 C3.1 JP6.3 38.1,12.38 33.97,12.38 33.34,11.75 33.34,3.49 33.97,2.86 45.72,2.86 | 40.01,40.01 v40.01,45.72 | v52.7,33.97 C8.1 53.66,27.62 54.61,26.67 54.61,23.5 45.72,14.61 45.72,2.86 | v52.7,35.24 55.56,38.1 C22.1 | v40.01,48.26 42.86,51.12 50.16,51.12 50.8,51.75 50.8,71.75 53.47,74.42 60.33,74.42 | PS1.3 126.36,81.28 | 126.36,81.28 TP2.P$1 132.08,72.07 132.08,60.96 L1.2 | R11.1 85.09,73.15 83.82,74.42 74.93,74.42 | 74.93,74.42 66.67,74.42 | 66.67,74.42 60.33,74.42 | CNANO1.VTG 66.67,74.42 | JP1.8 126.36,81.28 | R3.2 99.06,112.08 | J2.2 40.01,40.01 | 45.72,2.86 70.48,2.86 71.12,3.49 71.12,16.19 70.49,16.82 C25.1 66.99,17.14 U13.8
  Bottom 0.508: v40.01,45.72 v40.01,48.26 | v52.7,33.97 v52.7,35.24
+12V
  Top 0.508: J6.P$8 136.65,97.79 126.36,97.79 | 126.36,97.79 U5.10 121.92,97.79 121.28,98.42 121.28,108.58 110.49,119.38 31.11,119.38 26.62,114.89 26.62,45.45 TP6.P$1 24.09,42.82 VR2.VIN | PS1.1 126.36,97.79
  Bottom 0.508: VR2.VIN C6.1 | PS1.1 117.47,91.44 116.84,90.81 JP1.1 | C28.1 132.66,97.28 J6.P$8
A0A
  Top 0.203: J1.P$3 128.27,31.75 126.4,29.88 122.47,29.88 RN2.5
  Bottom 0.508: J1.P$3 133.99,36.2 TVS2.4
A0B
  Top 0.203: RN1.5 112.75,7.34 115.57,10.16 132.08,10.16 132.4,9.84 132.4,8.57 J4.P$1
  Bottom 0.508: TVS1.6 132.72,8.25 J4.P$1
A1A
  Top 0.203: RN2.6 126.28,30.71 127.95,32.38 127.95,36.51 128.27,36.83 J1.P$5
  Bottom 0.508: TVS2.6 131.54,38.2 130.18,36.83 J1.P$5
A1B
  Top 0.203: RN1.6 112.94,8.48 115.25,10.79 135.25,10.79 135.57,10.48 135.57,9.21 135.89,8.89 J4.P$3
  Bottom 0.508: TVS1.4 135.79,10.26 J4.P$3
A2A
  Top 0.203: RN2.7 126.12,31.51 127.32,32.7 127.32,41.59 127.64,41.91 J1.P$7
  Bottom 0.508: J1.P$7 130.18,41.91 131.54,40.55 TVS2.1
A2B
  Top 0.203: J4.P$5 135.89,13.97 135.57,13.65 135.57,12.38 135.25,12.06 115.25,12.06 112.47,9.28 RN1.7
  Bottom 0.508: TVS1.3 135.79,12.61 J4.P$5
A3A  (via drill 0.35)
  Top 0.203: J3.P$6 138.43,39.37 | 138.43,39.37 139.06,40.01 139.06,43.81 138.43,44.45 J3.P$8 135.89,43.18 v133.11,43.18 | 138.43,39.37 139.06,38.73 139.06,34.92 138.43,34.29 | J3.P$4 138.43,34.29 | J3.P$2 138.43,29.21 139.06,29.84 139.06,33.66 138.43,34.29 | RN2.8 122.15,42.77 122.55,43.18 R16.1 v131.05,43.18
  Bottom 0.203: v131.05,43.18 v133.11,43.18
  Bottom 0.508: TVS2.3 133.98,42.3 v133.11,43.18
A3B
  Top 0.203: RN1.8 112.67,10.44 114.94,12.7 132.08,12.7 132.4,13.02 132.4,14.29 J4.P$7
  Bottom 0.508: TVS1.1 132.72,14.61 J4.P$7
ADCVDD  (via drill 0.35)
  Top 0.203: U9.8 111.12,36.2 108.9,38.42 R22.1 | R27.1 98.75,15.87 101.6,13.02 U10.8
  Top 0.254: U9.8 115.57,36.2 C12.1 | U10.8 106.36,13.02 C13.1
  Top 0.508: v95.25,38.73 95.25,28.89 94.3,27.94 C21.1 92.71,27.62 U11.18 | 117.47,41.27 117.47,45.72 118.11,46.35 132.08,46.35 | 117.47,41.27 117.47,36.83 117.16,36.52 C12.1 | v95.25,41.27 117.47,41.27 | C13.1 108.91,12.7 118.11,21.91 v132.08,21.91 | L1.1 132.08,46.35 | v132.08,26.04 132.08,46.35
  Bottom 0.508: v132.08,21.91 v132.08,26.04 | v95.25,38.73 v95.25,41.27
BEEP  (via drill 0.35)
  Top 0.203: CNANO1.PB2 107.31,43.5 107,43.18 93.66,43.18 93.34,42.86 v93.34,41.27 | v93.34,38.73 84.77,30.16 v84.77,16.19 | J10.2 77.47,13.97 77.79,14.29 v84.77,14.29
  Bottom 0.203: v84.77,16.19 v84.77,14.29 | v93.34,38.73 v93.34,41.27
COLL-RX
  Top 0.203: JP1.3 114.3,88.9 108.9,88.9 108.58,88.58 108.58,85.43 U12.6
COLL-TX  (via drill 0.35)
  Top 0.203: JP1.7 v109.22,81.28 | U12.3 106.05,83.48 106.05,81.6 106.36,81.28 v107.95,81.28
  Bottom 0.203: v109.22,81.28 v107.95,81.28
CP3
  Top 0.203: J7.CP1 13.34,31.11 | 13.34,31.11 J7.CP3 17.14,31.11 21.27,26.98 R5.2 | J7.CP2 13.34,31.11
FAN  (via drill 0.35)
  Top 0.203: CNANO1.PB3 109.86,42.86 109.54,42.55 94.61,42.55 94.3,42.23 v94.3,41.27 | v85.72,16.19 85.72,30.16 v94.3,38.73 | v85.72,14.29 86.36,13.65 J9.2
  Bottom 0.203: v94.3,41.27 v94.3,38.73 | v85.72,16.19 v85.72,14.29
GND  (via drill 0.35)
  Top 0.203: U8.5 U8.4 v100.97,105.41 | v109.86,36.2 109.86,36.83 109.49,37.2 U9.1
  Top 0.254: U9.3 v109.86,36.2 | U10.3 v100.33,13.02
  Top 0.305: U12.2 v104.78,84.45 | C2.2 30.16,26.98 v30.48,26.67 31.5,25.65 U3.2 | U7.2 U7.5 v74.93,37.47
  Top 0.406: U4.5 52.68,25.7 C8.2 | U4.5 U4.6 U4.7 | U4.4 47.33,25.7 v47.62,25.72 47.65,25.7 U4.5
  Top 0.508: U5.9 v118.75,97.79 | C11.2 110.17,113.98 v109.86,113.97 | U8.9 v100.97,99.06 | C23.2 111.44,86.36 v109.86,86.36 | C9.2 76.52,114.94 v74.93,114.94 | C10.2 77.15,94.61 v78.74,94.61 | U14.1 U14.2 U14.3 U14.4 47.62,78.57 v47.62,77.47 | C27.2 v57.78,78.74 | C26.2 v31.75,77.47 | U6.5 40.01,78.66 v40.01,77.47 | C21.2 92.39,29.53 v90.17,29.53 | C22.2 v67,36.2 v66.99,36.2 | C3.2 36.51,27.62 v36.2,27.62 | VR2.GND 22.82,33.66 6.35,33.66 5.71,33.02 J7.GND | U13.5 66.99,13.34 67.31,13.65 C25.2 v69.21,14.93 v69.22,14.92 | U2.3 v66.04,107.95 | U2.5 v66.04,105.41 | U2.9 v66.04,100.33 | v66.04,87.63 U1.3 U1.4 | U1.9 v66.04,80.01 | U11.9 80.57,16.75 v80.01,16.19 77.16,16.19 R15.1 | v124.46,90.17 v124.46,92.71 | v108.58,27.94 C15.2 C16.2 v104.78,27.94 | v112.39,27.94 C1.2 C14.2 v116.2,27.94 | R16.2 v123.83,39.37 | v99.06,4.76 C20.2 C17.2 v95.25,4.76 | v102.87,4.76 C19.2 C18.2 v106.68,4.76 | R5.1 v25.4,25.09 v25.4,25.08 | CNANO1.GND24 v112.39,51.75 | CNANO1.VOFF v56.52,67.63 | v67.94,73.03 v74.3,73.03 | CNANO1.GND52 v64.14,67.63 | CNANO1.GND42 v89.53,67.63 | CNANO1.GND33 v112.39,67.63 | C13.2 v108.27,14.61 | C8.2 v52.7,24.45 | v120.65,90.17 v120.65,92.71 | C12.2 v113.67,38.41 v113.67,38.42 | CNANO1.GND15 v89.53,51.75
  Bottom 0.203: U15.3 5.73,28.56 J7.GND
  pour Bottom: 27.94,8.26 21.59,14.61 21.59,48.26 19.05,50.8 0,50.8 0,121.92 142.24,121.92 142.24,47.62 142.2,0 27.94,0
GND-1  (via drill 4.83 pad 8.89)
  other vias: 20.83,5.33
  pour Bottom: 0,0 26.67,0 26.67,7.62 20.32,13.97 20.32,47.62 18.41,49.53 0,49.53
INT-PNEU  (via drill 0.35)
  Top 0.203: U1.8 69.22,81.28 69.53,80.96 69.53,79.06 69.22,78.74 v69.22,75.56 | CNANO1.PD7-AIN7 v69.22,72.07
  Bottom 0.203: v69.22,72.07 v69.22,75.56
N$1
  Top 0.203: U2.17 80.01,109.22 84.45,113.67 86.23,113.67 R14.2 JP3.1
N$2
  Top 0.203: U2.16 81.28,107.95 84.45,111.12 86.23,111.12 R14.3 JP3.3
N$3
  Top 0.203: U2.15 82.55,106.68 84.45,108.58 86.23,108.58 R14.4 JP3.5
N$4
  Top 0.203: U2.14 83.82,105.41 84.45,106.05 86.23,106.05 R14.5 JP3.7
N$5
  Top 0.203: R4.2 77.16,21.27 U11.6 U11.5 U11.4 U11.3
N$6  (via drill 0.35)
  Top 0.203: v130.81,67.31 122.87,67.31 122.56,67.63 CNANO1.PF2
  Bottom 0.203: JP7.2 v130.81,67.31
N$7
  Bottom 0.203: JP7.3 R7.2
N$8
  Top 0.203: U13.4 58.42,13.3
  Top 0.508: J5.2 58.42,10.16 58.42,13.3
  Bottom 0.508: C24.2 60.32,4.76 60.96,5.4 J5.2
N$9
  Top 0.203: U1.17 80.01,88.9 84.45,93.34 86.23,93.34 R11.9 JP3.17
N$10
  Top 0.203: R11.8 86.3,90.87 | 86.3,90.87 86.23,90.81 84.45,90.81 81.28,87.63 U1.16 | 86.3,90.87 90.87,90.87 JP3.19
N$11
  Top 0.203: U1.15 82.55,86.36 84.45,88.27 86.23,88.27 R11.7 JP3.21
N$12
  Top 0.203: R11.6 86.3,85.79 | 86.3,85.79 86.23,85.72 84.45,85.72 83.82,85.09 U1.14 | JP3.23 90.87,85.79 86.3,85.79
N$13
  Top 0.203: U1.13 83.82,83.82 84.45,83.19 86.23,83.19 R11.5 JP3.25
N$14
  Top 0.203: R2.1 63.82,83.82 U1.6 U1.5
N$15
  Top 0.203: U1.11 81.28,81.28 84.45,78.11 86.23,78.11 R11.3 JP3.29
N$16
  Top 0.203: U1.10 80.01,80.01 84.45,75.56 86.23,75.56 R11.2 JP3.31
N$17
  Top 0.203: U2.12 82.55,102.87 84.45,100.97 86.23,100.97 R14.7 JP3.11
N$18
  Top 0.203: R15.2 77.16,18.73 U11.8
N$19
  Top 0.203: J5.3 56.83,9.21 56.83,15.56 57.15,15.88 U13.2
N$20
  Top 0.203: R11.4 86.3,80.71 | 86.3,80.71 86.23,80.64 84.45,80.64 82.55,82.55 U1.12 | JP3.27 90.87,80.71 86.3,80.71
N$21
  Top 0.203: U2.11 81.28,101.6 84.45,98.42 86.23,98.42 R14.8 JP3.13
N$22
  Top 0.203: U2.10 80.01,100.33 84.45,95.89 86.23,95.89 R14.9 JP3.15
N$23
  Top 0.203: J5.1 63.5,10.79 59.69,14.61 U13.3
N$24
  Top 0.203: R13.1 63.82,104.14 U2.6 69.22,104.14 69.53,104.46 69.53,106.36 69.22,106.68 U2.4
N$25
  Top 0.508: U13.1 56.2,17.14 55.88,16.83 J5.4
  Bottom 0.508: C24.1 56.52,4.76 55.88,5.4 J5.4
N$26
  Top 0.203: R6.1 JP7.1
N$28
  Top 0.203: C1.1 111.44,31.43 111.12,31.75 111.12,35.24 111.58,35.7 U9.7 113.85,35.7 115.25,34.29 120.02,34.29 120.42,33.88 RN2.1
N$36
  Top 0.203: U2.13 83.82,104.14 84.45,103.5 86.23,103.5 R14.6 JP3.9
N$37
  Top 0.203: U5.1 U8.17
N$38
  Top 0.203: U8.16 U5.2
N$39
  Top 0.203: U5.3 U8.15
N$43
  Top 0.203: R9.1 32.06,19.68 33.97,19.68 34.29,20 34.29,24.77 34.67,25.15 U3.6
N$44
  Top 0.203: U8.14 U5.4
N$45
  Top 0.203: U5.5 U8.13
N$46
  Top 0.203: U8.12 U5.6
N$47
  Top 0.203: U5.7 U8.11
N$48
  Top 0.203: U8.10 U5.8
N$49
  Top 0.203: U8.3 99.38,106.68 99.22,106.84 | 99.22,106.84 R3.1 | U8.6 99.38,102.87 99.06,103.19 99.06,106.68 99.22,106.84
N$50
  Top 0.508: J8.P$8 137.03,120.02 133.03,120.02 129.22,120.02 128.91,119.7 128.91,108.27 128.59,107.95 U5.18
N$51
  Top 0.508: J8.P$1 137.03,102.23 135.89,102.23 135.57,101.92 135.57,99.38 135.25,99.06 U5.11
N$52
  Top 0.508: J8.P$2 137.03,104.78 134.94,104.78 134.62,104.46 134.62,100.65 134.3,100.33 U5.12
N$53
  Top 0.508: J8.P$3 137.03,107.31 133.99,107.31 133.67,107 133.67,101.92 133.35,101.6 U5.13
N$54
  Top 0.508: J8.P$4 137.03,109.86 133.03,109.86 132.72,109.54 132.72,103.19 132.4,102.87 U5.14
N$55
  Top 0.508: J8.P$5 137.03,112.39 132.08,112.39 131.76,112.08 131.76,104.46 131.44,104.14 U5.15
N$56
  Top 0.508: J8.P$6 137.03,114.94 131.13,114.94 130.81,114.62 130.81,105.73 130.49,105.41 U5.16
N$57
  Top 0.508: J8.P$7 137.03,117.47 130.18,117.47 129.86,117.16 129.86,107 129.54,106.68 U5.17
N$60
  Top 0.203: U11.10 90.81,17.46 96.52,23.18 136.84,23.18 137.16,23.5 J3.P$1
N$61
  Top 0.203: U11.12 90.81,20 94.61,23.81 134.94,23.81 135.25,24.13 135.25,31.43 135.57,31.75 J3.P$3
N$62
  Top 0.203: C16.1 | C16.1 104.78,33.34 107.13,35.7 U9.4 | C16.1 103.19,31.43 102.87,31.11 102.87,26.67 103.19,26.35 120.02,26.35 120.42,26.76 RN2.4
N$63
  Top 0.203: U9.5 108.34,31.68 C15.1 | C15.1 | RN2.3 119.61,30.71 119.38,30.48 119.38,27.3 119.06,26.99 110.81,26.99 110.49,27.3 110.49,31.11 110.17,31.43 C15.1
N$64
  Top 0.203: U9.2 104.95,36.7 R22.2
N$65
  Top 0.203: C19.1 101.6,9.52 101.6,12.38 101.73,12.52 U10.7 104,12.52 106.05,10.48 110.22,10.48 RN1.1
N$66
  Top 0.203: RN2.2 116.28,31.51 C14.1 115.25,31.43 112.71,33.97 112.71,35.12 U9.6
N$67
  Top 0.203: RN1.2 110.18,9.21 107.63,9.21 C18.1 106.56,8.25 103.11,11.7 U10.6
N$68
  Top 0.203: U10.5 98.81,8.5 C20.1 100.65,8.25 100.97,7.94 100.97,4.13 101.28,3.81 108.58,3.81 108.99,4.22 108.99,8.17 109.31,8.48 RN1.3
N$69
  Top 0.203: U10.4 95.7,12.52 95.25,12.06 C17.1 93.98,8.25 93.66,7.94 93.66,3.49 93.98,3.17 109.86,3.17 110.17,3.49 110.17,7.3 110.21,7.34 RN1.4
N$70
  Top 0.203: U10.2 U10.1 95.3,14.02 R27.2
N$71
  Top 0.203: U11.14 90.81,22.54 92.71,24.45 133.99,24.45 134.3,24.77 134.3,36.51 134.62,36.83 J3.P$5
N$72
  Top 0.203: U11.16 133.03,25.08 133.35,25.4 133.35,41.59 133.67,41.91 J3.P$7
NANO-RX0
  Top 0.203: U3.8 35.2,46.32 35.56,46.67 71.44,46.67 71.75,46.99 CNANO1.PA1-RX
NANO-RX1
  Top 0.203: CNANO1.PC1-RX 94.61,51.44 108.58,65.41 108.58,83.48 U12.4
NANO-RX3  (via drill 0.35)
  Top 0.203: U13.6 62.59,14.61 61.95,15.24 v61.91,15.24 | CNANO1.PB1-RX 104.78,44.13 104.46,43.81 88.58,43.81 61.91,17.14 v61.91,16.51
  Bottom 0.203: v61.91,16.51 v61.91,15.24
NANO-TX0
  Top 0.203: CNANO1.PA0-TX 69.22,47.62 68.9,47.31 32.38,47.31 32.1,47.03 U3.1
NANO-TX1
  Top 0.203: CNANO1.PC0-TX 92.08,51.44 103.5,62.87 103.5,85.09 103.82,85.41 U12.1
NANO-TX3
  Top 0.203: CNANO1.PB0-TX 102.23,44.77 101.92,44.45 88.27,44.45 61.28,17.46 61.28,16.23 61.63,15.88 U13.7
OLED/RST  (via drill 0.35)
  Top 0.203: v39.37,12.06 40.01,12.7 40.01,25.4 41.27,26.67 41.27,30.8 48.9,38.42 v48.9,46.04 | CNANO1.PD6-AIN6 71.75,67.94 71.44,67.63 68.58,67.63 v48.9,47.94
  Bottom 0.203: v48.9,47.94 v48.9,46.04 | v39.37,12.06 39.37,8.89 JP6.4
SCL  (via drill 0.35)
  Top 0.203: U2.1 72.07,110.49 72.39,110.17 72.39,90.81 71.75,90.17 | 71.75,90.17 U1.1 64.45,90.17 TP4.P$1 41.91,112.71 BO1.3 41.91,115.25 41.27,115.89 29.84,115.89 28.57,114.62 28.57,74.61 28.89,74.3 52.07,74.3 55.88,78.11 55.88,79.69 55.56,80.01 U14.6 52.07,80.01 48.26,76.2 45.4,76.2 45.09,76.52 45.09,79.38 41.91,82.55 U6.8 | U11.1 83.19,27.62 83.82,26.99 83.82,15.88 84.14,15.56 91.44,15.56 93.98,18.1 98.42,18.1 102.55,13.97 103.07,13.97 U10.10 | U8.1 105.73,109.22 106.05,108.9 106.05,97.16 98.42,89.53 98.42,64.77 85.72,52.07 77.15,52.07 76.83,51.75 | JP6.6 35.56,8.26 36.2,8.89 43.5,8.89 43.81,9.21 43.81,26.67 44.14,27 U4.2 46.68,27 46.99,27.3 46.99,34.29 47.31,34.61 v73.66,34.61 | v73.03,75.56 73.03,88.9 71.75,90.17 | U9.10 112.03,37.2 108.9,40.32 93.03,40.32 80.57,27.86 U11.1 | v75.88,53.34 73.34,53.34 73.03,53.66 v73.03,67.31 | v73.66,35.88 73.68,35.9 U7.4 73.69,36.83 75.56,36.83 75.88,37.15 75.88,44.13 76.2,44.45 R12.1 | v75.88,52.07 76.52,52.07 76.83,51.75 | R12.1 77.47,48.9 CNANO1.PA3-SCL 76.83,51.75 | R12.1 78.74,44.45 79.06,44.13 79.06,40.96 77.79,39.69 v77.79,35.56 | v79.69,33.66 79.69,27.86 79.93,27.62 U11.1
  Bottom 0.203: v73.03,67.31 v73.03,75.56 | v75.88,53.34 v75.88,52.07 | v73.66,35.88 v73.66,34.61 | v77.79,35.56 v79.69,33.66
SDA  (via drill 0.35)
  Top 0.203: U6.7 41.91,81.28 43.81,79.38 43.81,75.56 | 43.81,75.56 44.13,75.25 50.96,75.25 53.81,78.11 U14.5 | JP6.1 41.27,10.79 41.27,25.4 43.52,27.64 U4.1 45.58,33.83 56.2,44.45 R1.1 | 81.92,26.35 82.55,25.72 82.55,15.24 82.87,14.92 91.76,14.92 94.3,17.46 98.11,17.46 102.05,13.52 U10.9 | U9.9 111.58,36.7 108.58,39.69 93.34,39.69 82.55,28.89 v82.55,28.26 | U8.2 104.46,107.95 104.78,107.63 104.78,98.42 95.89,89.53 95.89,64.77 83.82,52.7 74.61,52.7 74.3,52.39 | 74.3,52.39 CNANO1.PA2-SDA 74.3,49.21 73.66,48.58 R1.1 | v71.12,89.53 69.85,88.27 | v71.12,90.81 71.12,108.9 70.8,109.22 U2.2 | 69.85,88.27 69.22,88.9 U1.2 61.91,88.9 39.37,111.44 | 69.85,88.27 70.48,87.63 v70.48,75.56 | 81.92,26.35 U11.2 79.38,26.35 79.06,26.67 v79.06,33.02 | v82.55,26.99 81.92,26.35 | 74.3,52.39 73.98,52.7 70.8,52.7 70.48,53.02 v70.48,66.99 | R1.1 74.93,44.45 75.25,44.13 v75.25,40.01 73.68,38.44 U7.6 | 43.81,75.56 43.5,75.25 30.16,75.25 29.84,75.56 29.84,101.92 TP3.P$1 39.37,111.44 | 39.37,111.44 BO1.2 | v77.15,34.92 v77.15,40.01
  Bottom 0.203: v71.12,89.53 v71.12,90.81 | v70.48,75.56 v70.48,66.99 | v82.55,28.26 v82.55,26.99 | v75.25,40.01 v77.15,40.01 | v79.06,33.02 v77.15,34.92
T-ALERT
  Top 0.203: U4.3 47.94,26.34 48.26,26.67 48.26,30.16 R10.1
VBAT  (via drill 0.35)
  Top 0.305: v41.27,87 38.1,83.82 38.1,80.64 38.73,80.01 U6.6
  Top 0.508: BT1.S+1 BT1.S+2
  Bottom 0.305: BT1.S+1 41.35,87.08 v41.27,87
XP-RX
  Top 0.203: U3.4 31.47,24.65 29.76,22.94 16.43,22.94 J7.RX
XP-TX
  Top 0.203: U3.5 35.56,24.3 35.56,18.1 35.24,17.78 19.05,17.78 9.53,27.3 J7.TX
XP/RST
  Bottom 0.203: U15.4 8.26,24.46 J7./RST
XPORT/RESET  (via drill 0.35)
  Top 0.203: CNANO1.PC3 99.69,45.4 99.38,45.09 88.27,45.09 76.83,33.66 66.67,33.66 46.99,13.97 v46.99,3.81 | v4.13,23.18 4.13,21.59 4.45,21.27 13.65,21.27 33.34,1.59 46.67,1.59 v46.99,1.91
  Bottom 0.203: v46.99,3.81 v46.99,1.91 | U15.2 4.45,23.5 v4.13,23.18

### Text on the board
tPlace: Accelerometer | GND | SDA | Use CR2032 Battery | SCL | +5V Supply | Clock | FRAM | Collimator / Motors USART | Pneumatics / Sensors | +5V | 2021-02-21 / BOSS Motion Controller | SP1 | GND | SP2 | Select | +12V | GND | +5V | +3.3V / Supply | I2C Driver | Temperature | Analog / Corner | AD590 on/off | * | Chassis / ground | Beeper | Fan | OLED Display | LN2 Controller
tNames: Slit ID | High Current / Driver | +12V | TX | GND | RX | +5V | GND | Microchip Curiosity Nano ATMega4809 | Temperature / & Humidity | USB Power | Level Shifter | Ion Pump | Lantronix XPORT